# EasyEDA Pro project logic_G1.epro, schematic SCH, sheets 1 to 5 of 10

## Sheets
1 FPGA: Board Name: 立创·逻辑派—G1开发板; Create Date: 2025-03-18; Page Name: FPGA; Project Name: Logic_G1; Schematic Name: SCH; Update Date: 2025-03-18; Company: 嘉立创EDA; Page Size: A4; Version: V1.0
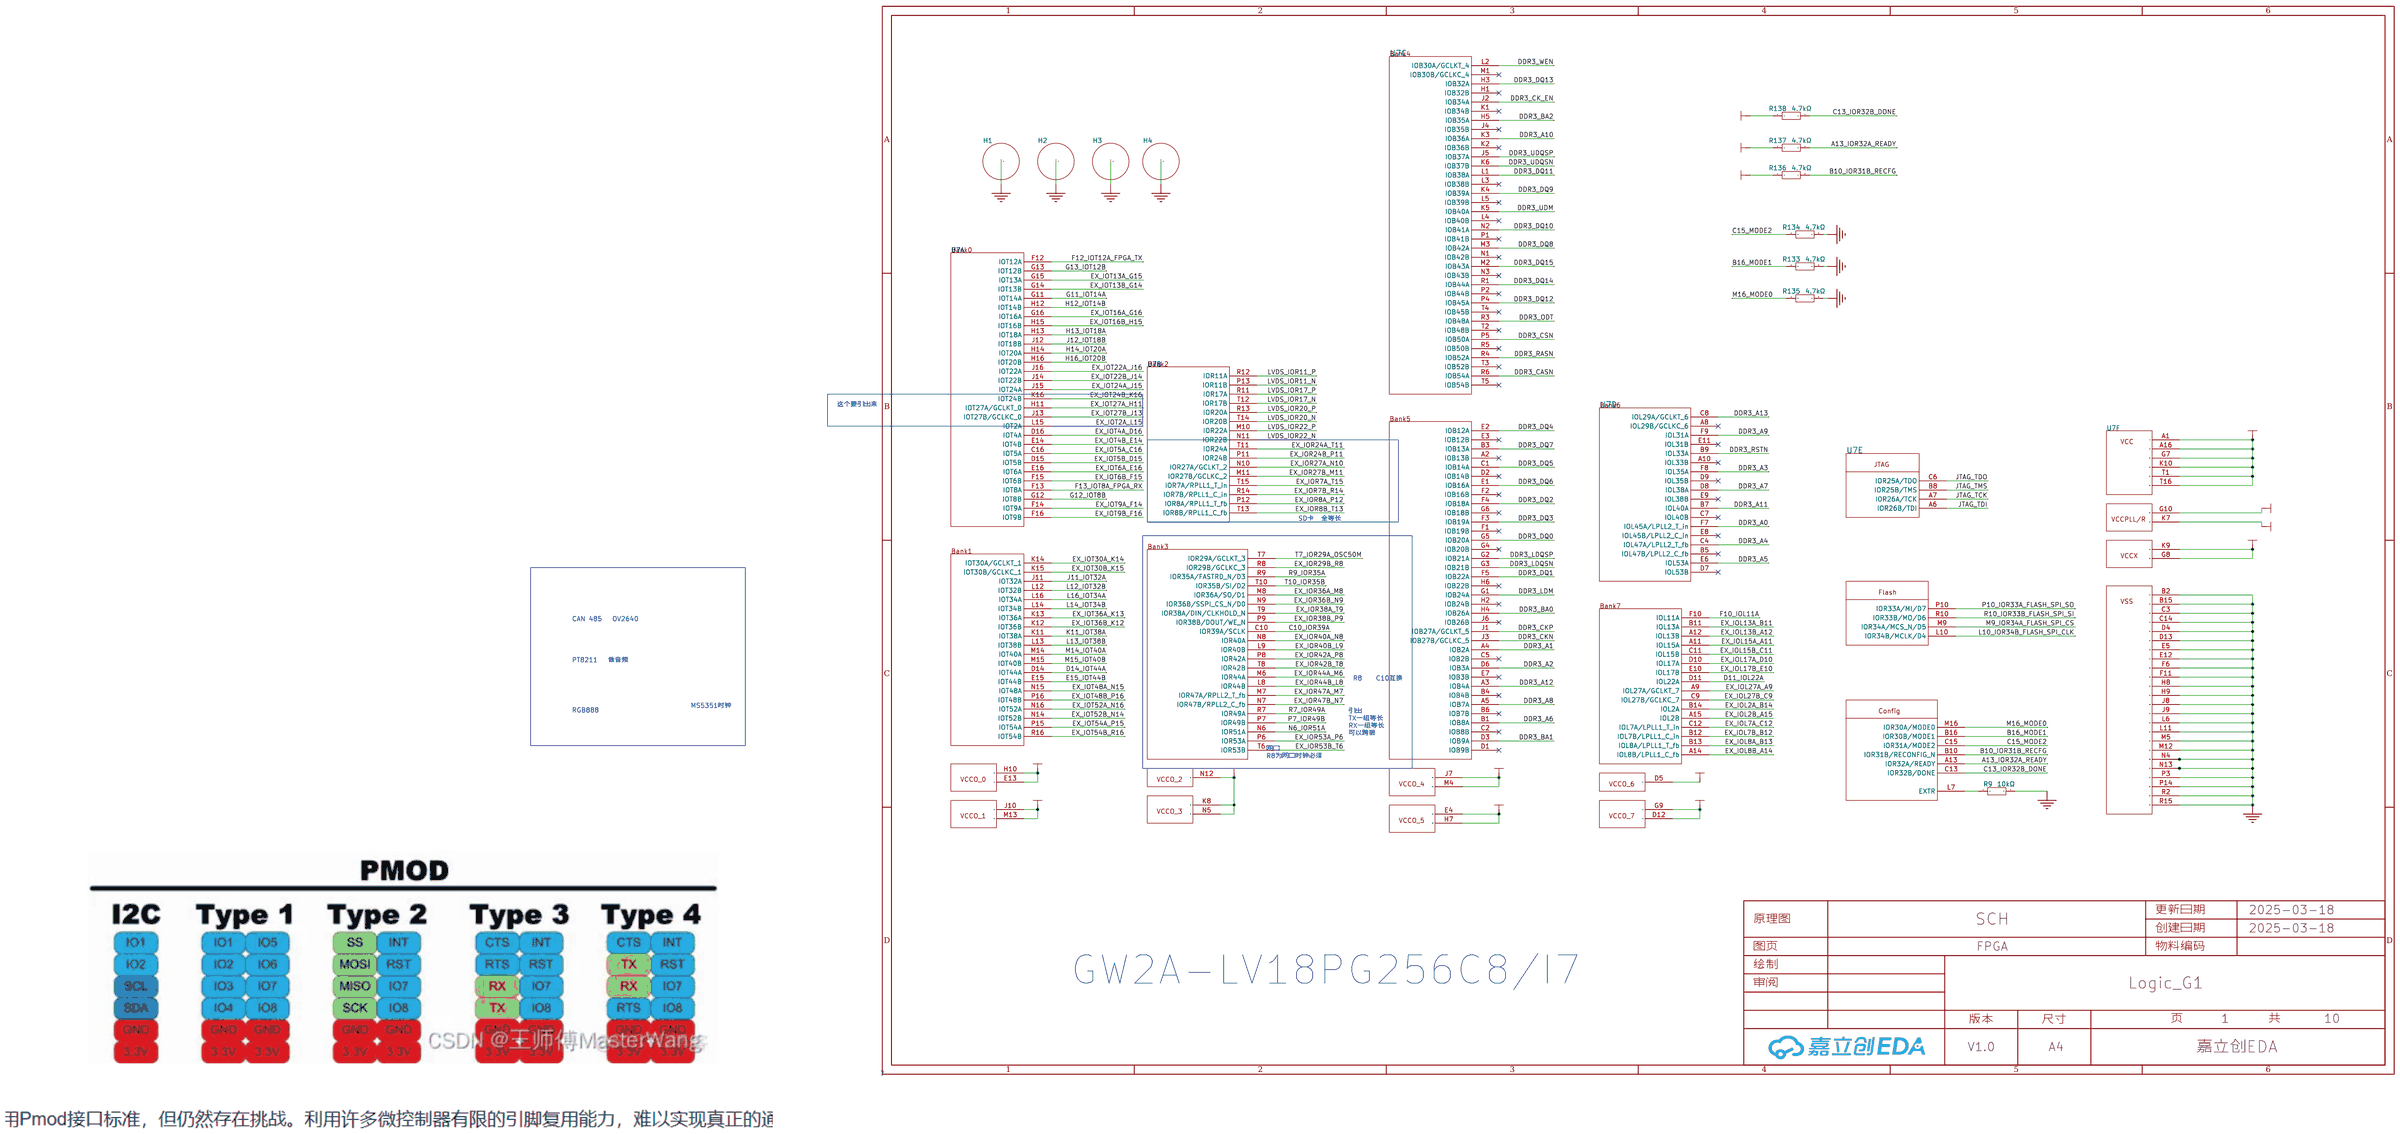
[diagram p0: FPGA]
2 GD32F303CBT6: Board Name: 第六版; Create Date: 2024-11-01; Page Name: GD32F303CBT6; Project Name: FPGA+MCU核心板; Schematic Name: SCH_13; Update Date: 2024-11-01
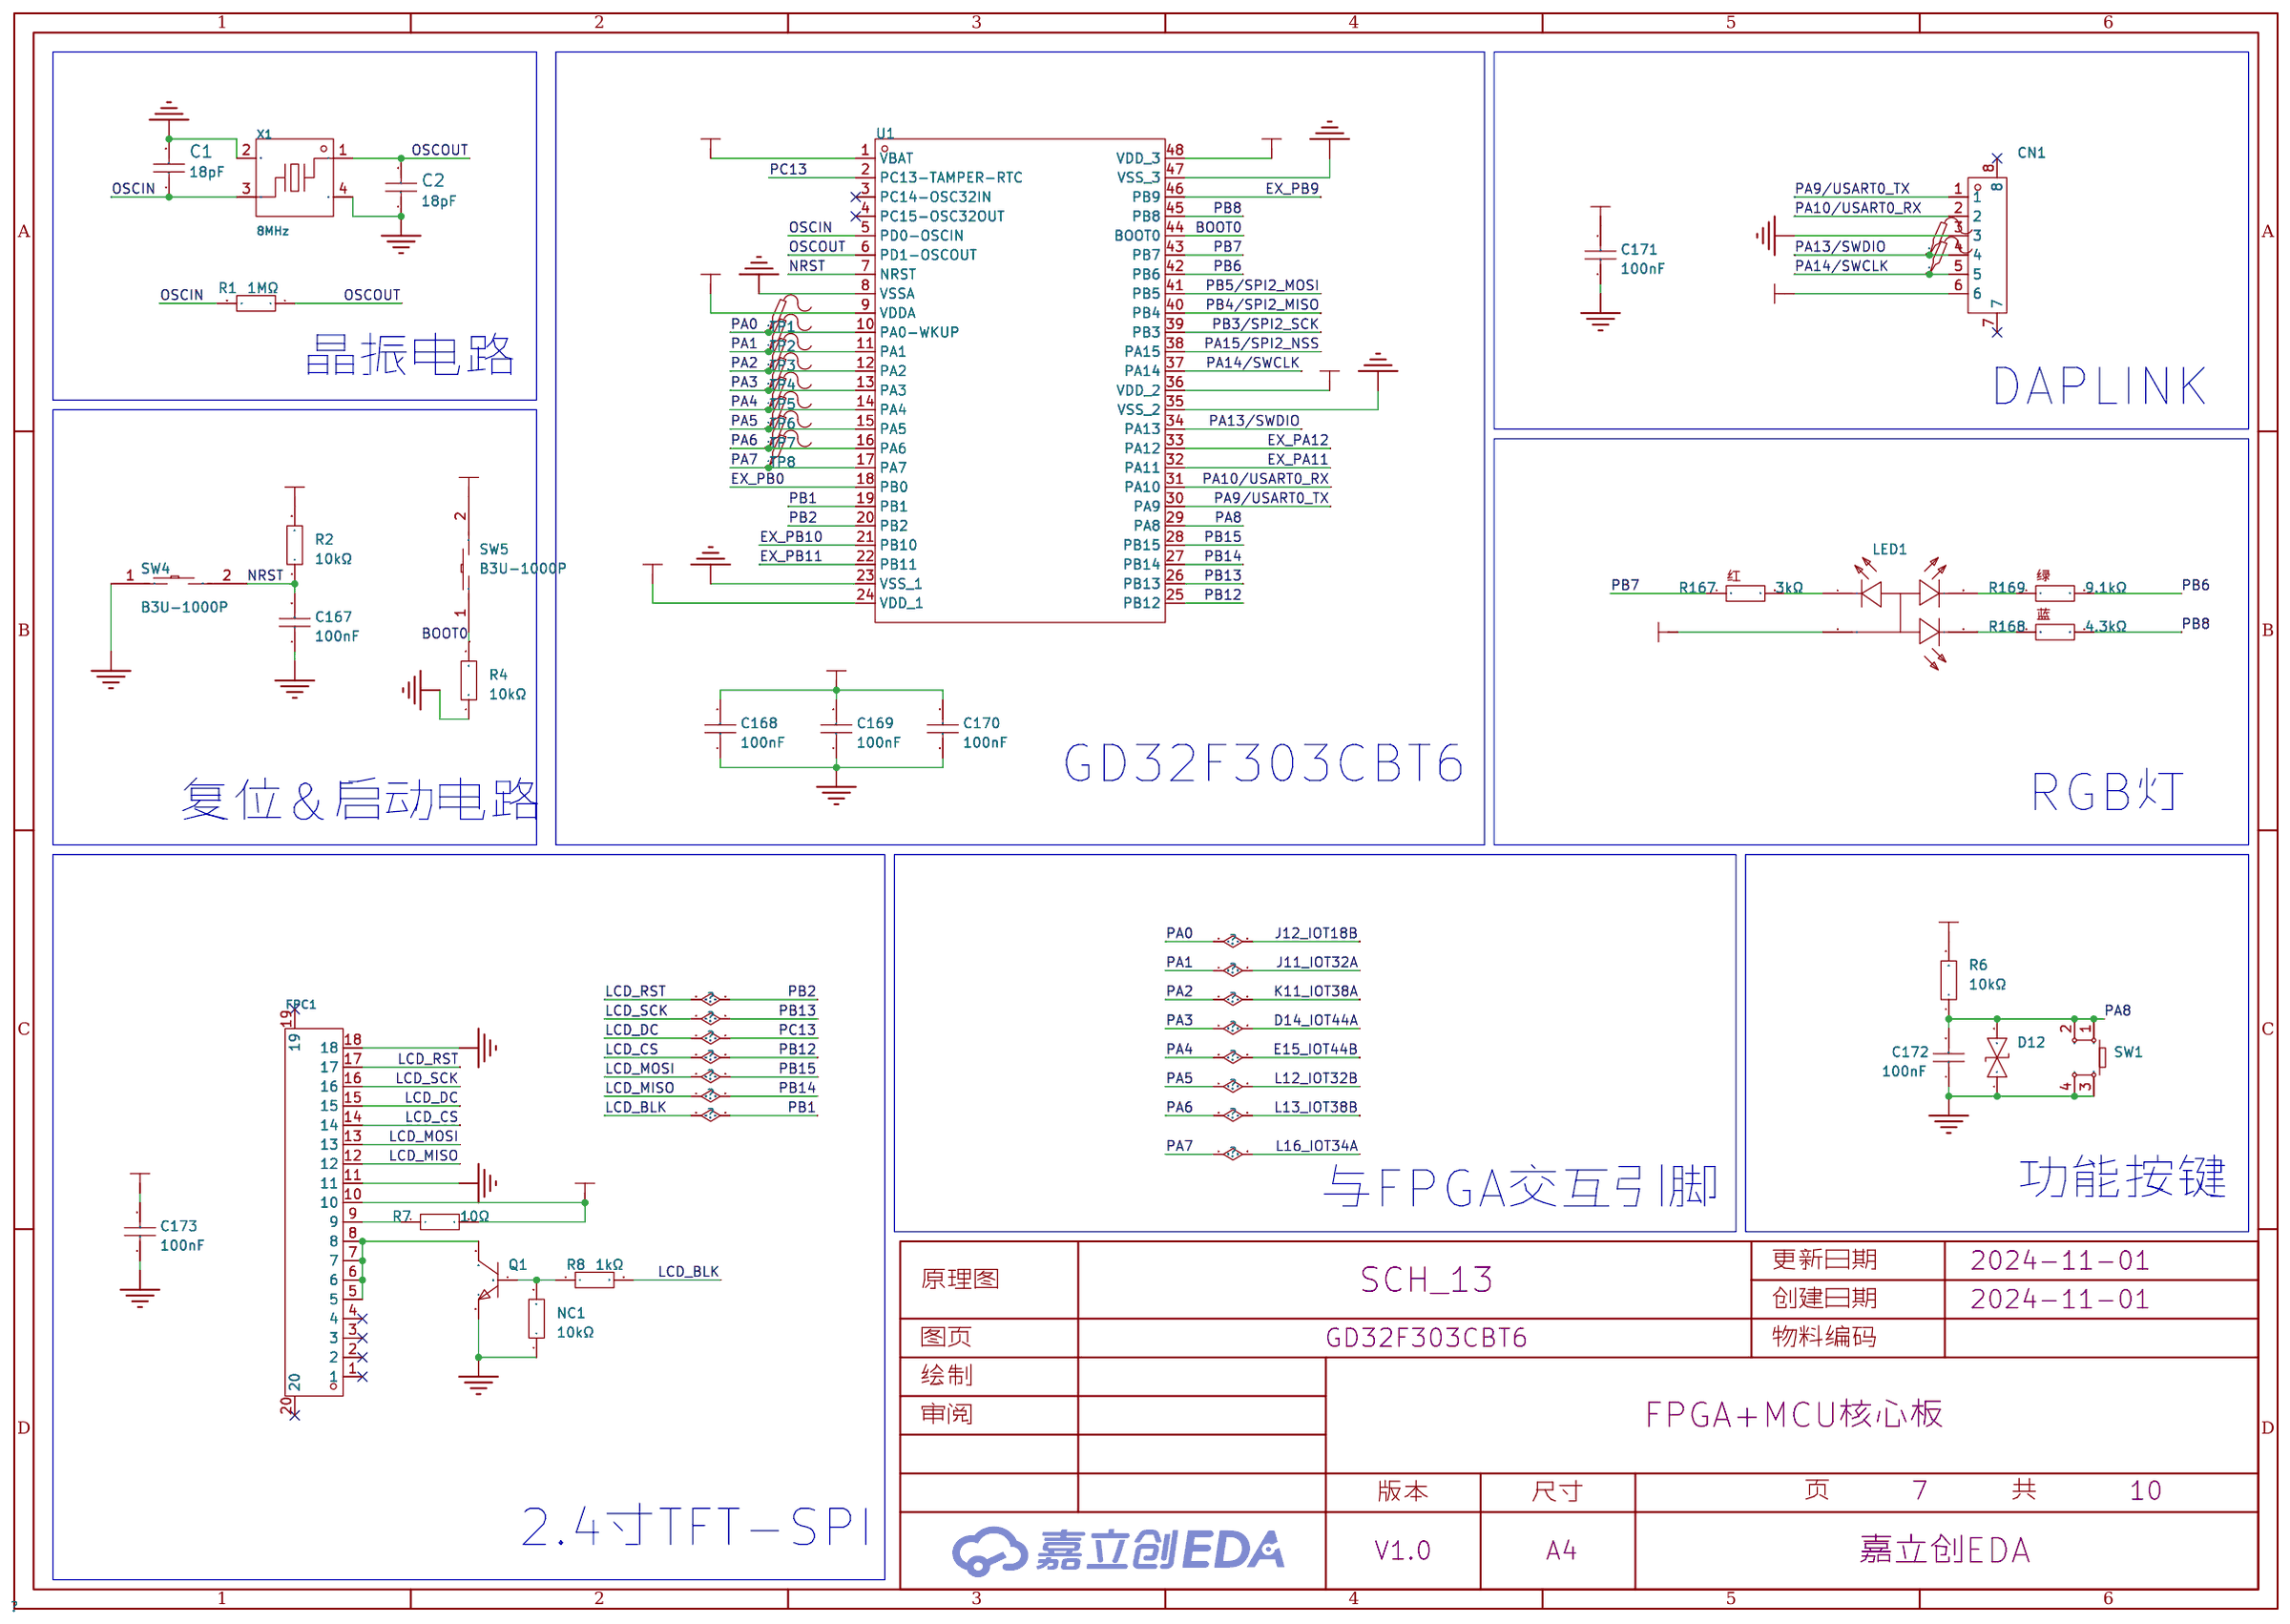
[diagram p1: GD32F303CBT6]
3 Expand: Board Name: 第六版; Create Date: 2024-11-01; Page Name: Expand; Project Name: FPGA+MCU核心板; Schematic Name: SCH_13; Update Date: 2024-11-01
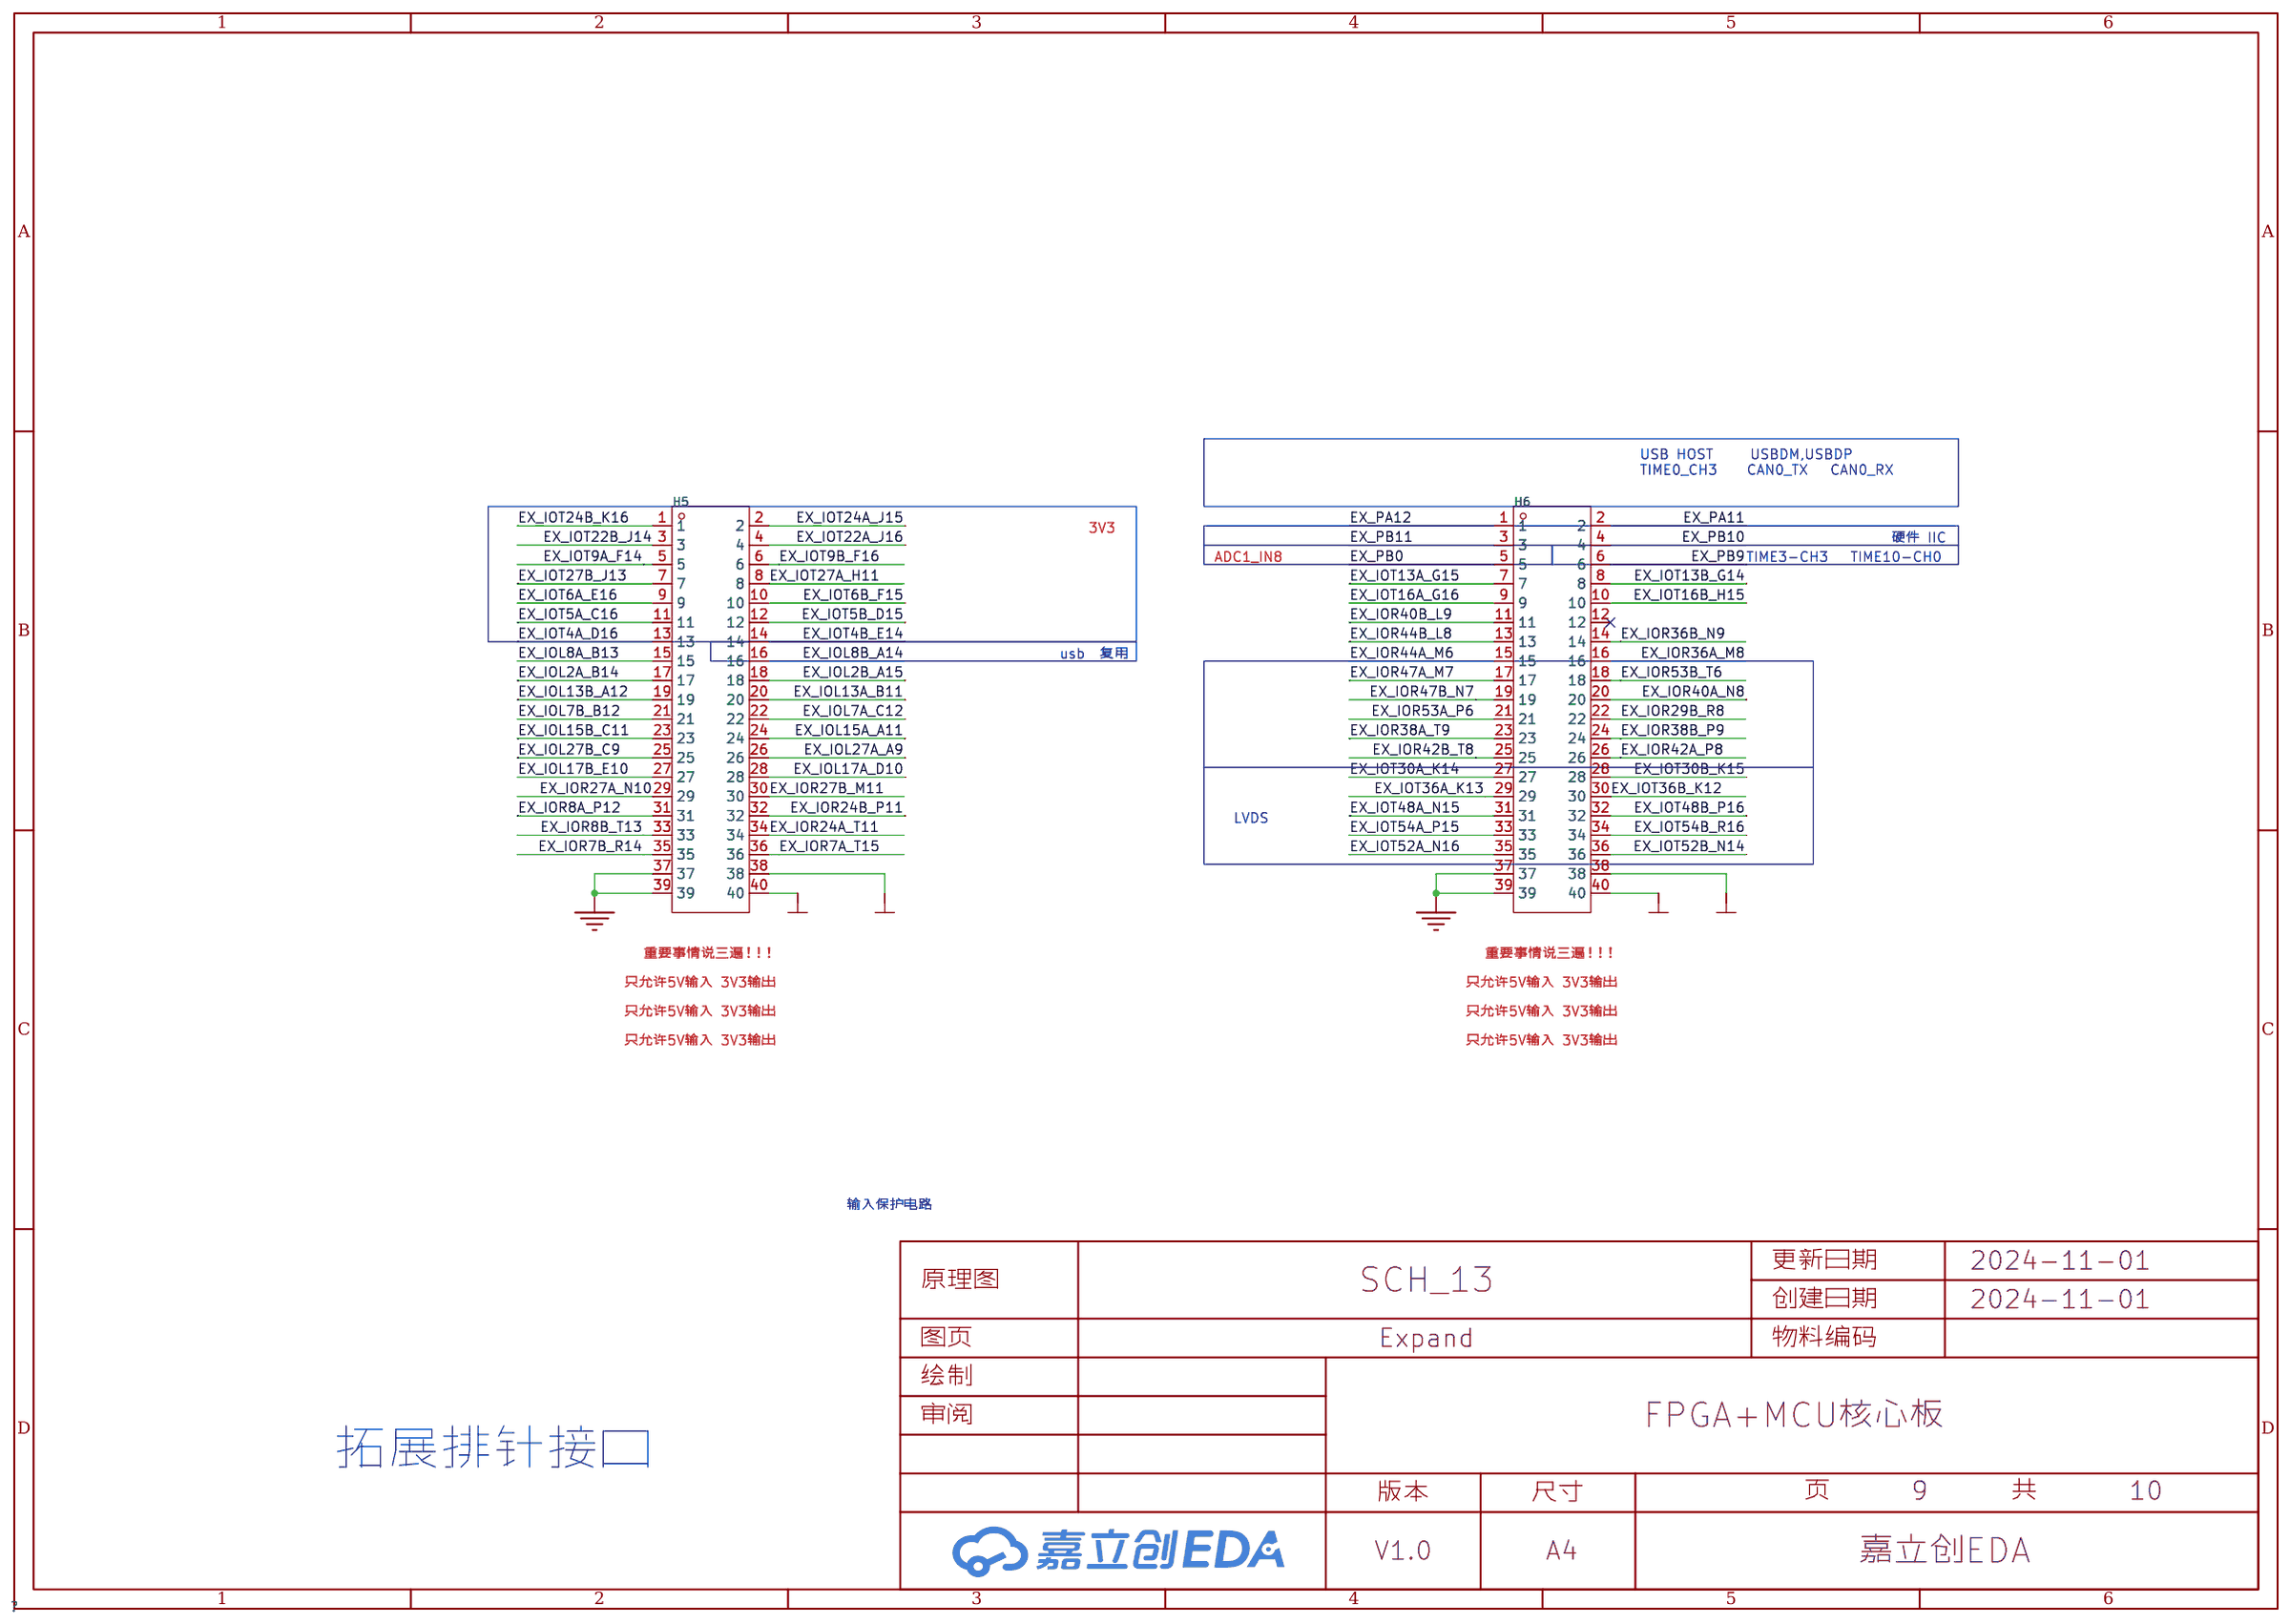
[diagram p2: Expand]
4 FPGA_Peripheral: Board Name: 第六版（单板）; Create Date: 2024-11-05; Page Name: FPGA_Peripheral; Project Name: FPGA+MCU核心板; Schematic Name: SCH_14; Update Date: 2024-11-05
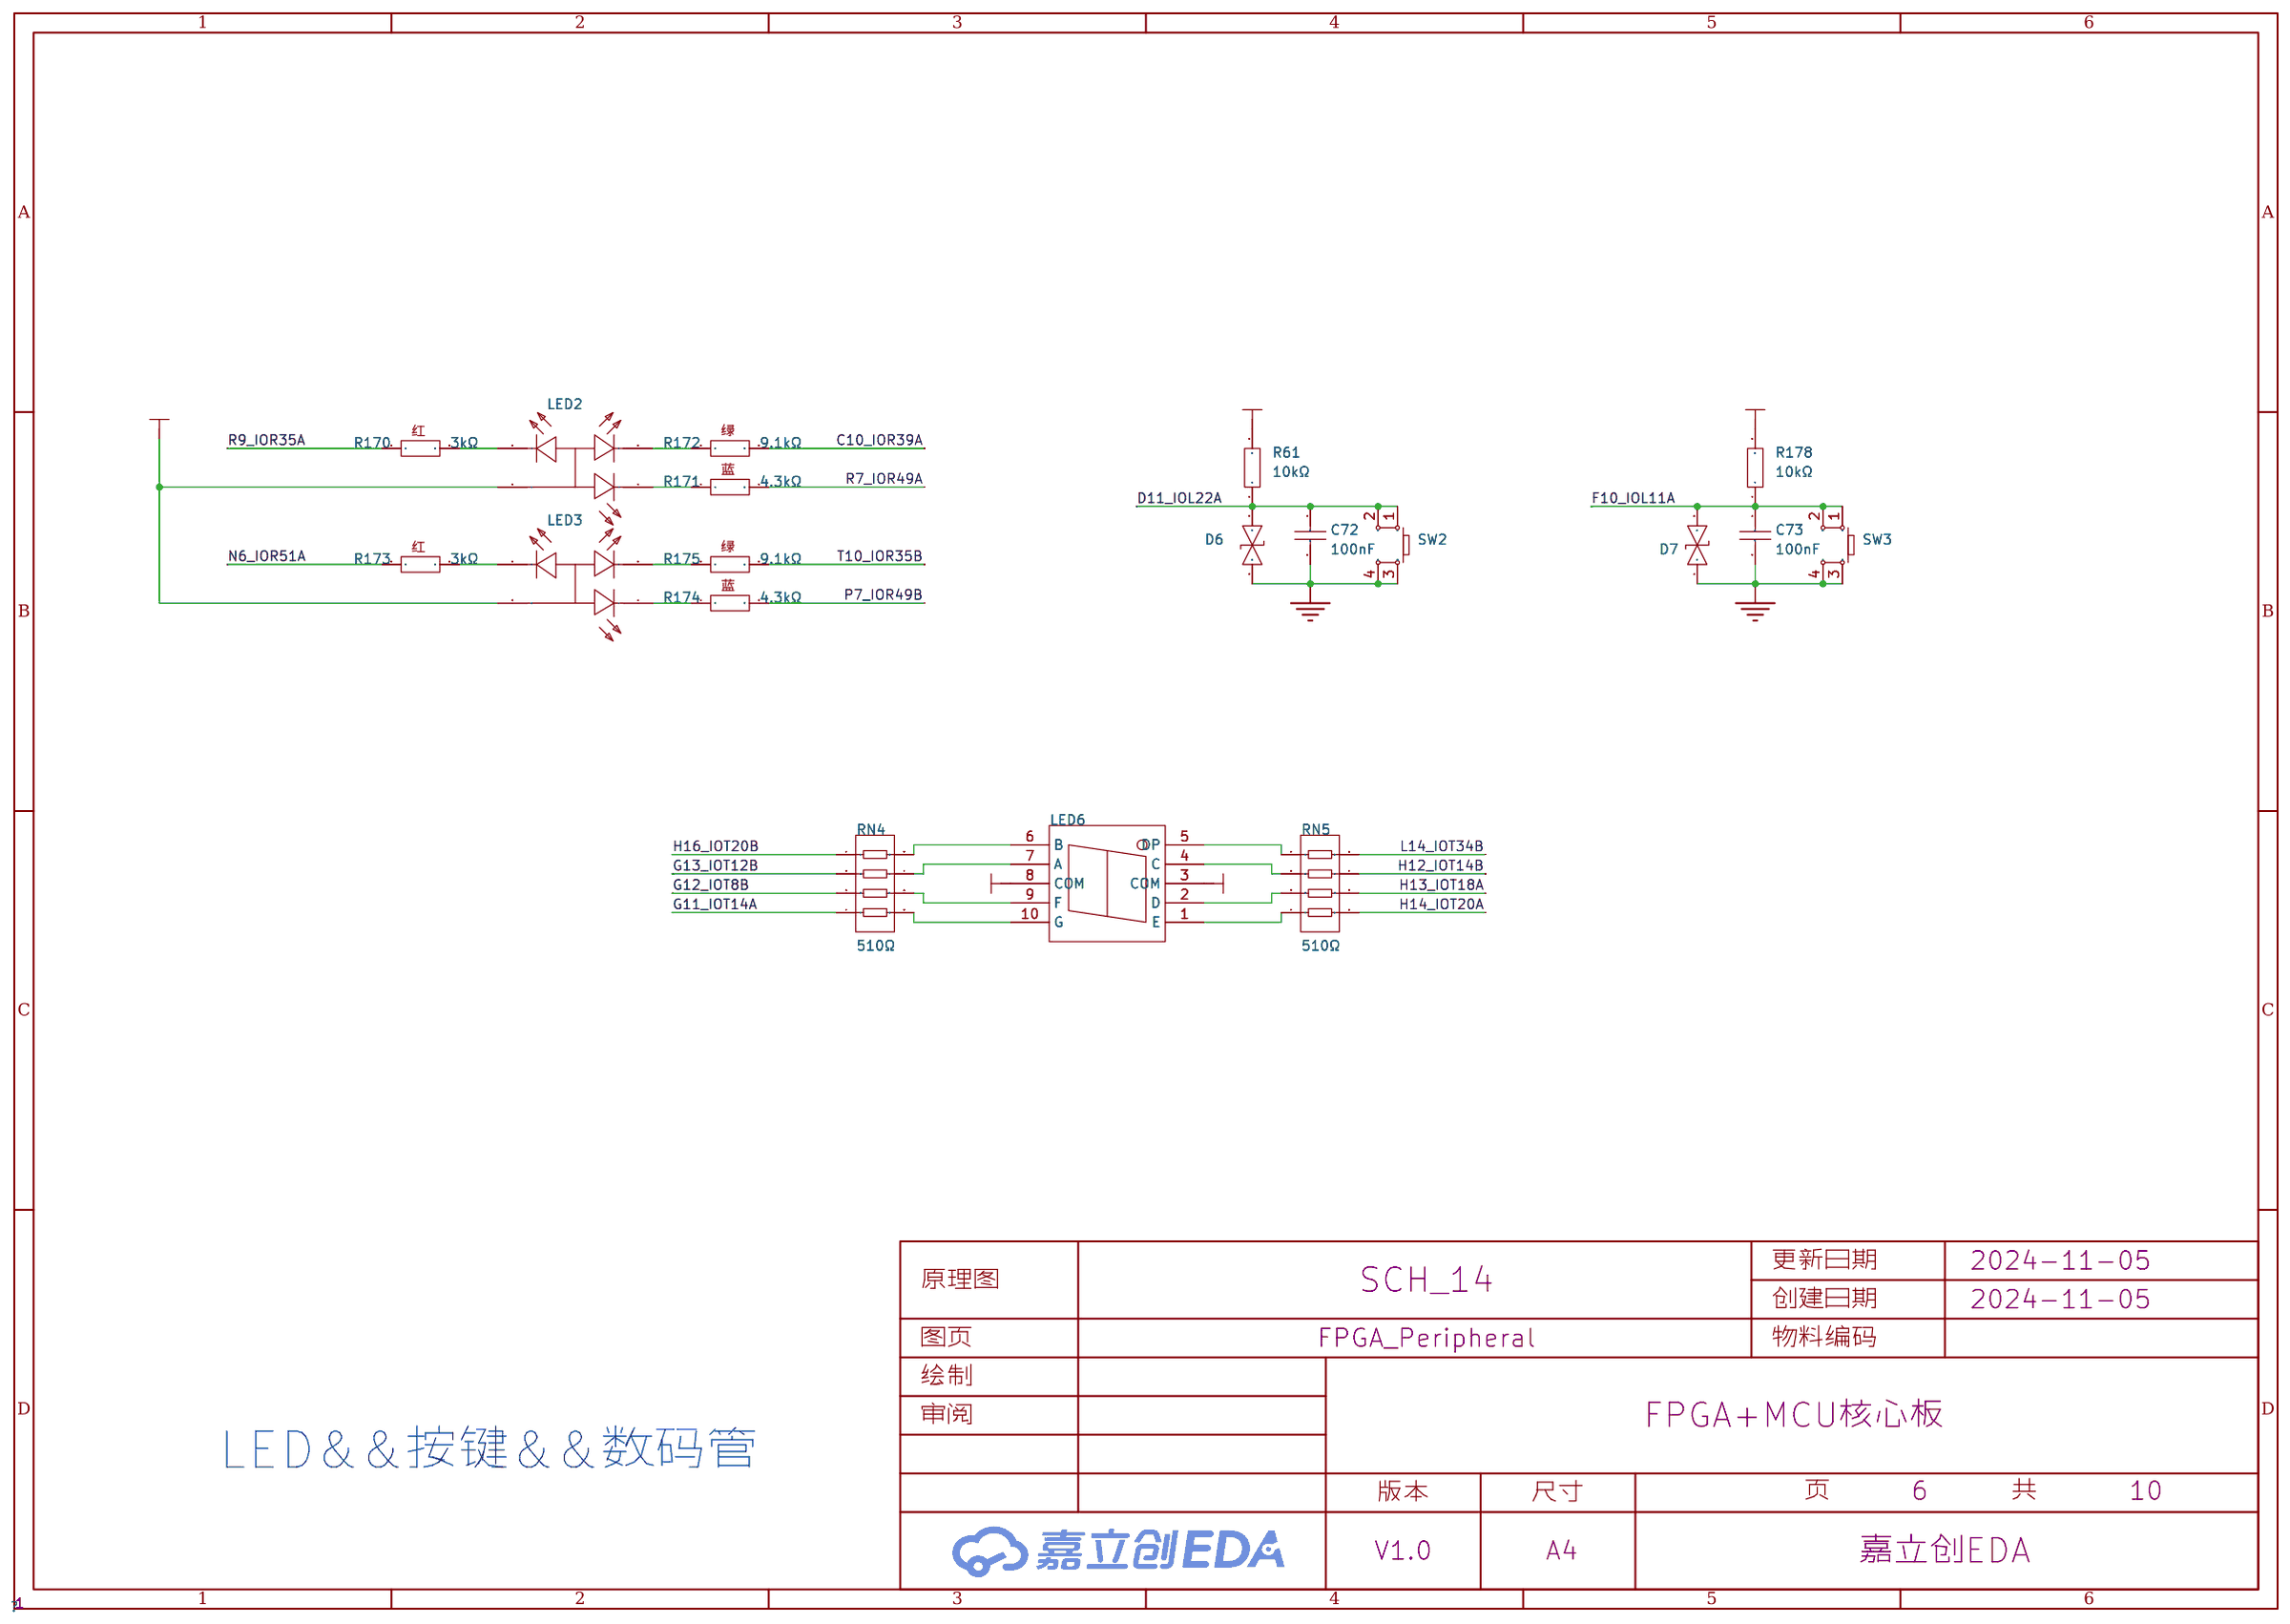
[diagram p3: FPGA_Peripheral]
5 Power: Board Name: 第六版; Create Date: 2024-11-01; Page Name: Power; Project Name: FPGA+MCU核心板; Schematic Name: SCH_13; Update Date: 2024-11-01
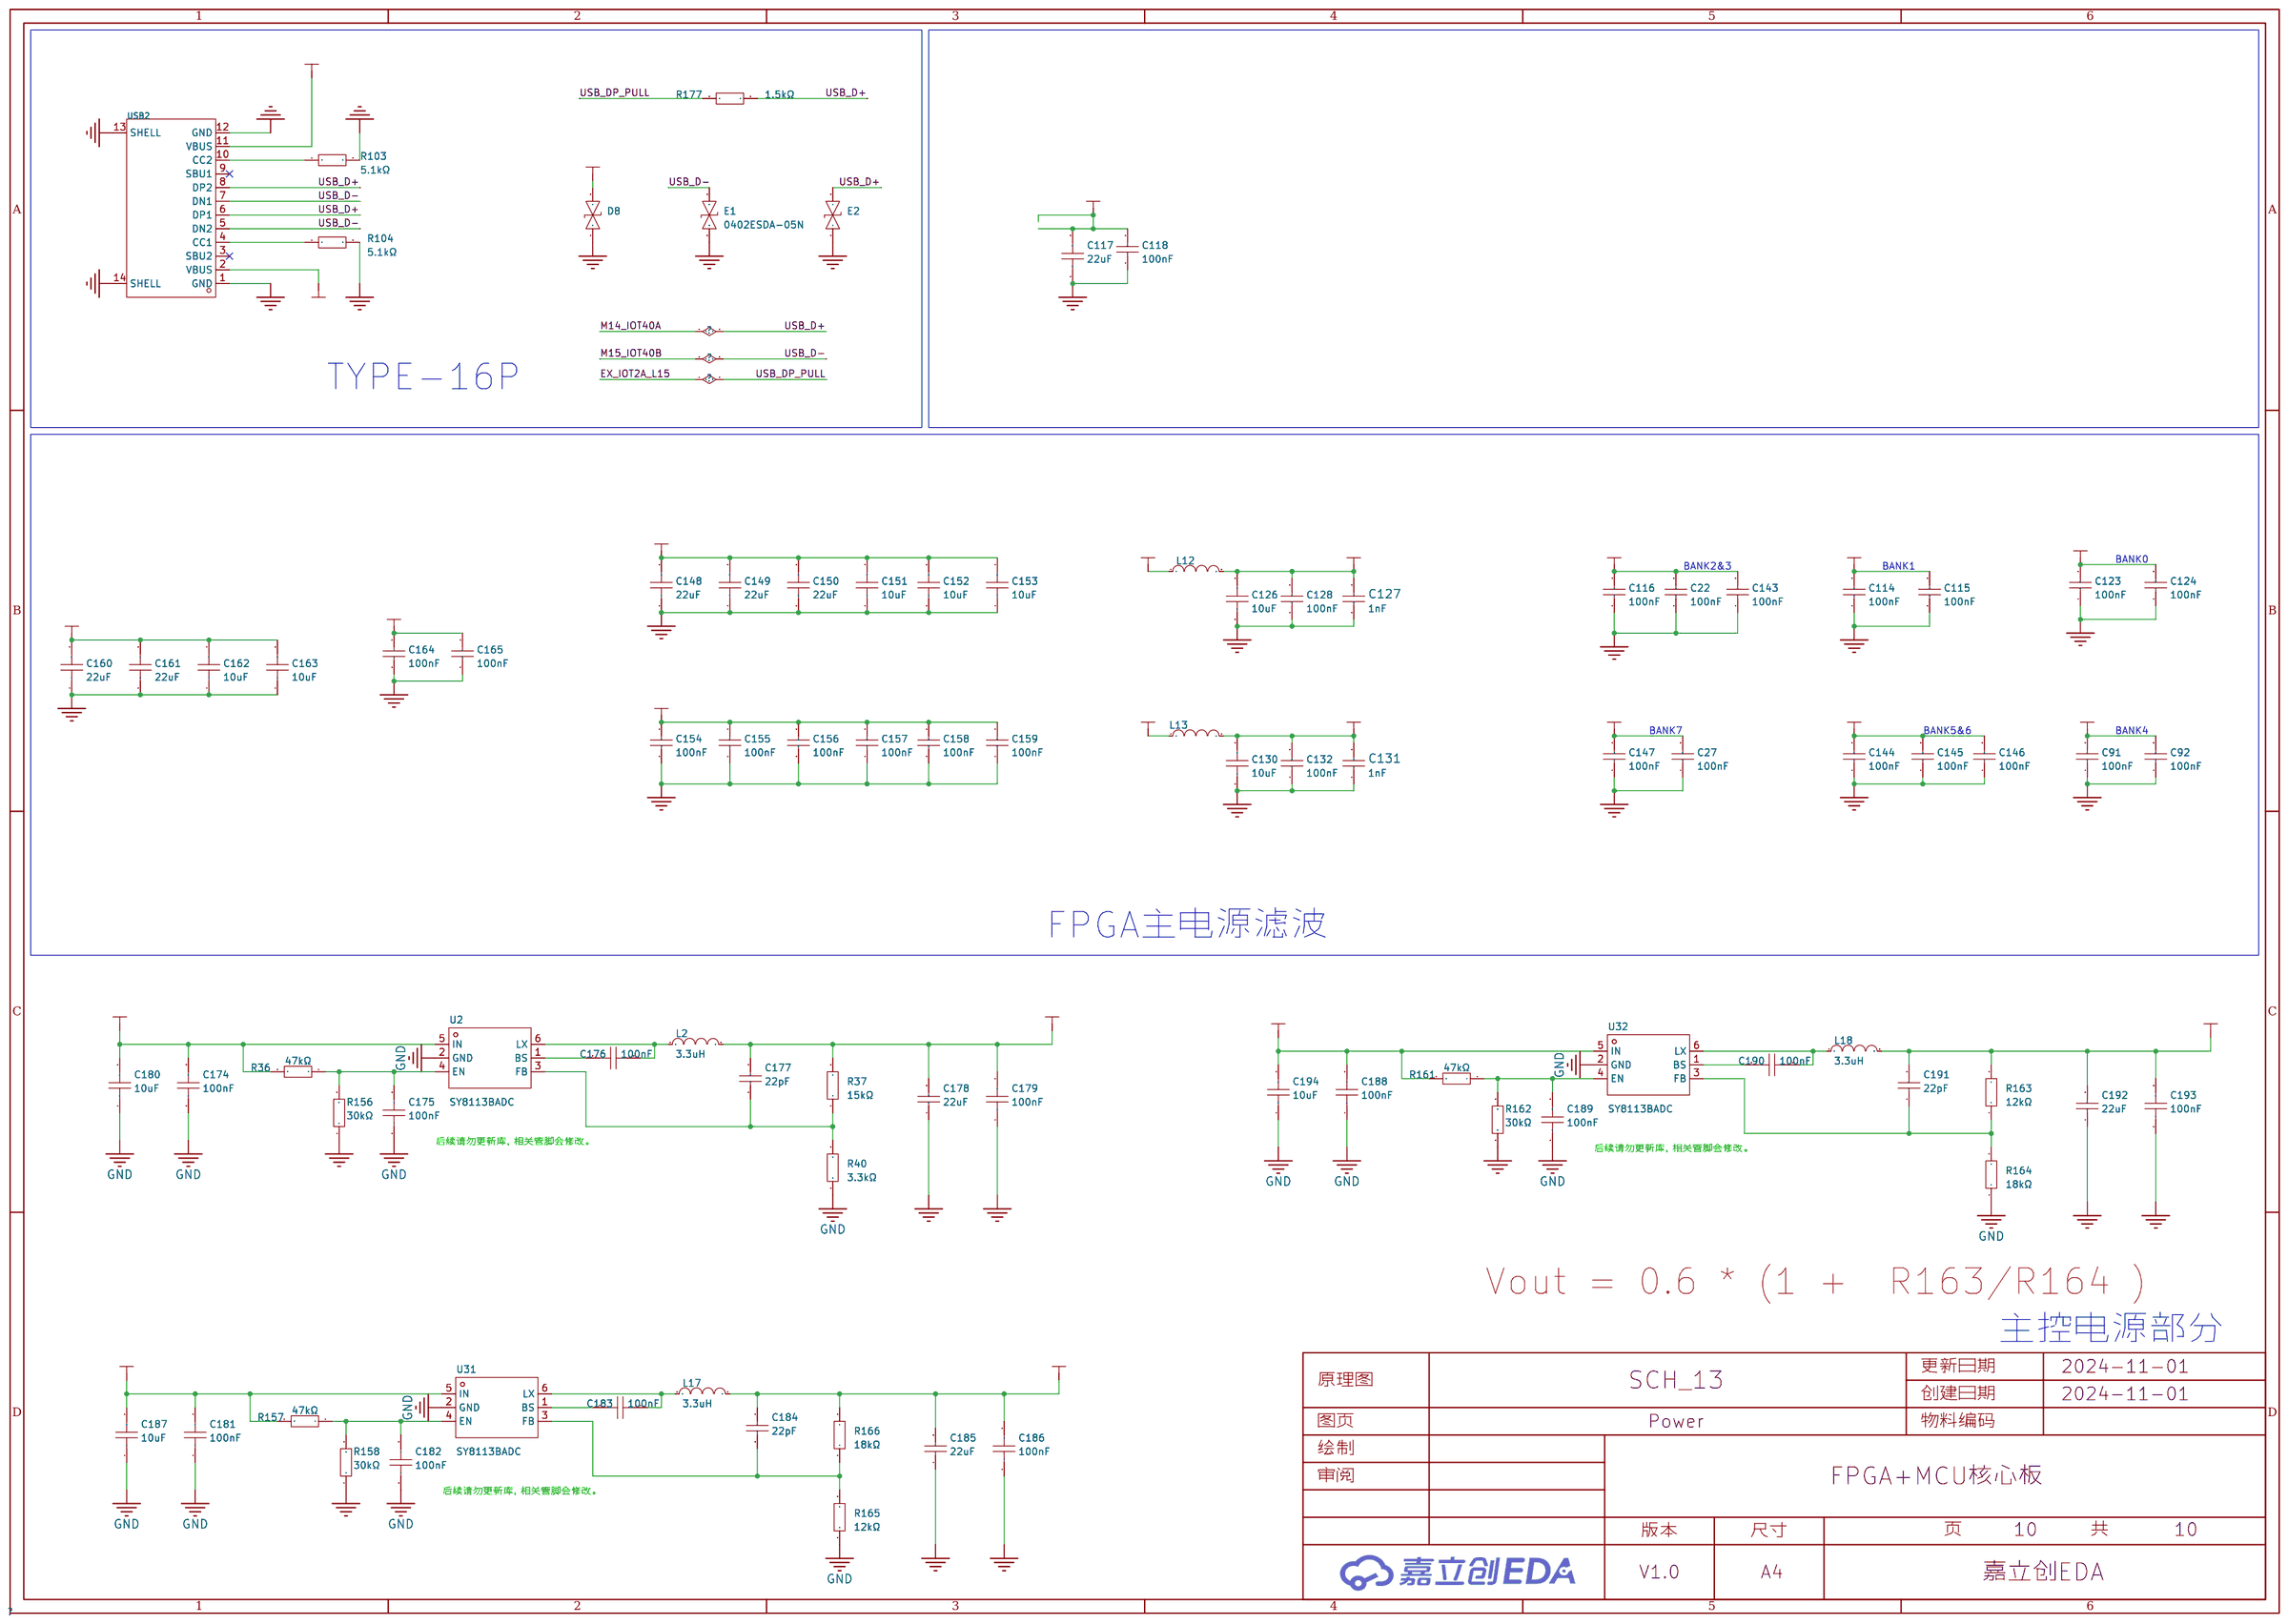
[diagram p4: Power]

## Parts
sheet Expand
H5  12251220ANG0S115001  [HDR-TH_40P-P2.54-V-M-R2-C20-S2.54]
H6  12251220ANG0S115001  [HDR-TH_40P-P2.54-V-M-R2-C20-S2.54]
sheet FPGA
H1  -  [125 X 300]
H2  -  [125 X 300]
H3  -  [125 X 300]
H4  -  [125 X 300]
R9  10kΩ  [R0402]
R133  4.7kΩ  [R0402]
R134  4.7kΩ  [R0402]
R135  4.7kΩ  [R0402]
R136  4.7kΩ  [R0402]
R137  4.7kΩ  [R0402]
R138  4.7kΩ  [R0402]
U7  -  [FBGA-256_L17.0-W17.0-R16-C16-P1.00-TL-1]  (sections Bank0-1,Bank2-3,Bank4-5,Bank6-7,Config,Power)
sheet FPGA_Peripheral
C72  100nF  [C0402]
C73  100nF  [C0402]
D6  0402ESDA-05N  [D0402-BI]
D7  0402ESDA-05N  [D0402-BI]
LED2  E6C0606RGBC3UDA  [LED-SMD_4P-L1.6-W1.6-TL-FD]
LED3  E6C0606RGBC3UDA  [LED-SMD_4P-L1.6-W1.6-TL-FD]
LED6  SLS0281FR1A1GD  [LED-SEG-SMD_SLS0281FR1A1GD]
R61  10kΩ  [R0402]
R170  3kΩ  [R0402]
R171  4.3kΩ  [R0402]
R172  9.1kΩ  [R0402]
R173  3kΩ  [R0402]
R174  4.3kΩ  [R0402]
R175  9.1kΩ  [R0402]
R178  10kΩ  [R0402]
RN4  510Ω  [RES-ARRAY-SMD_0402-8P-L2.0-W1.0-BL]
RN5  510Ω  [RES-ARRAY-SMD_0402-8P-L2.0-W1.0-BL]
SW2  PTS815SJK250SMTRLFS  [SW-SMD_4P-L4.2-W3.3-P2.15-LS5.1]
SW3  PTS815SJK250SMTRLFS  [SW-SMD_4P-L4.2-W3.3-P2.15-LS5.1]
sheet GD32F303CBT6
C1  18pF  [C0402]
C2  18pF  [C0402]
C167  100nF  [C0402]
C168  100nF  [C0402]
C169  100nF  [C0402]
C170  100nF  [C0402]
C171  100nF  [C0402]
C172  100nF  [C0402]
C173  100nF  [C0402]
CN1  WAFER-100W-6A  [CONN-SMD_6P-P1.00_XUNPU_WAFER-100W-6P]
D12  0402ESDA-05N  [D0402-BI]
FPC1  FPC-05F-18PH20  [FPC-SMD_18P-P0.50_FPC-05F-18PH20]
LED1  E6C0606RGBC3UDA  [LED-SMD_4P-L1.6-W1.6-TL-FD]
NC1  10kΩ  [R0402]
Q1  S8050 J3Y  [SOT-23-3_L3.0-W1.7-P0.95-LS2.9-BR]
R1  1MΩ  [R0402]
R2  10kΩ  [R0402]
R4  10kΩ  [R0402]
R6  10kΩ  [R0402]
R7  10Ω  [R0402]
R8  1kΩ  [R0402]
R167  3kΩ  [R0402]
R168  4.3kΩ  [R0402]
R169  9.1kΩ  [R0402]
SW1  PTS815SJK250SMTRLFS  [SW-SMD_4P-L4.2-W3.3-P2.15-LS5.1]
SW4  B3U-1000P  [KEY-SMD_B3U-1000PM]
SW5  B3U-1000P  [KEY-SMD_B3U-1000PM]
TP1  -  [Test-Point-0.5mm]
TP2  -  [Test-Point-0.5mm]
TP3  -  [Test-Point-0.5mm]
TP4  -  [Test-Point-0.5mm]
TP5  -  [Test-Point-0.5mm]
TP6  -  [Test-Point-0.5mm]
TP7  -  [Test-Point-0.5mm]
TP8  -  [Test-Point-0.5mm]
TP9  -  [Test-Point-0.5mm]
TP10  -  [Test-Point-0.5mm]
U1  GD32F303CBT6  [LQFP-48_L7.0-W7.0-P0.50-LS9.0-BL]
X1  8MHz  [OSC-SMD_4P-L3.2-W2.5-BL]
sheet Power
C22  100nF  [C0402]
C27  100nF  [C0402]
C91  100nF  [C0402]
C92  100nF  [C0402]
C114  100nF  [C0402]
C115  100nF  [C0402]
C116  100nF  [C0402]
C117  22uF  [C0603]
C118  100nF  [C0402]
C123  100nF  [C0402]
C124  100nF  [C0402]
C126  10uF  [C0603]
C127  1nF  [C0402]
C128  100nF  [C0402]
C130  10uF  [C0603]
C131  1nF  [C0402]
C132  100nF  [C0402]
C143  100nF  [C0402]
C144  100nF  [C0402]
C145  100nF  [C0402]
C146  100nF  [C0402]
C147  100nF  [C0402]
C148  22uF  [C0603]
C149  22uF  [C0603]
C150  22uF  [C0603]
C151  10uF  [C0603]
C152  10uF  [C0603]
C153  10uF  [C0603]
C154  100nF  [C0402]
C155  100nF  [C0402]
C156  100nF  [C0402]
C157  100nF  [C0402]
C158  100nF  [C0402]
C159  100nF  [C0402]
C160  22uF  [C0603]
C161  22uF  [C0603]
C162  10uF  [C0603]
C163  10uF  [C0603]
C164  100nF  [C0402]
C165  100nF  [C0402]
C174  100nF  [R0603]
C175  100nF  [R0402]
C176  100nF  [R0402]
C177  22pF  [R0402]
C178  22uF  [C0603]
C179  100nF  [R0603]
C180  10uF  [C0603]
C181  100nF  [R0603]
C182  100nF  [R0402]
C183  100nF  [R0402]
C184  22pF  [R0402]
C185  22uF  [C0603]
C186  100nF  [R0603]
C187  10uF  [C0603]
C188  100nF  [R0603]
C189  100nF  [R0402]
C190  100nF  [R0402]
C191  22pF  [R0402]
C192  22uF  [C0603]
C193  100nF  [R0603]
C194  10uF  [C0603]
D8  0402ESDA-05N  [D0402-BI]
E1  0402ESDA-05N  [D0402-BI]
E2  0402ESDA-05N  [D0402-BI]
L2  3.3uH  [IND-SMD_L4.4-W4.2]
L12  UPZ1005D121-1R3TF  [L0402]
L13  UPZ1005D121-1R3TF  [L0402]
L17  3.3uH  [IND-SMD_L4.4-W4.2]
L18  3.3uH  [IND-SMD_L4.4-W4.2]
R36  47kΩ  [R0402]
R37  15kΩ  [R0402]
R40  3.3kΩ  [R0402]
R103  5.1kΩ  [R0402]
R104  5.1kΩ  [R0402]
R156  30kΩ  [R0402]
R157  47kΩ  [R0402]
R158  30kΩ  [R0402]
R161  47kΩ  [R0402]
R162  30kΩ  [R0402]
R163  12kΩ  [R0402]
R164  18kΩ  [R0402]
R165  12kΩ  [R0402]
R166  18kΩ  [R0402]
R177  1.5kΩ  [R0402]
U2  SY8113BADC  [TSOT-23-6_L2.9-W1.6-P0.95-LS2.8-BR]
U31  SY8113BADC  [TSOT-23-6_L2.9-W1.6-P0.95-LS2.8-BR]
U32  SY8113BADC  [TSOT-23-6_L2.9-W1.6-P0.95-LS2.8-BR]
USB2  TYPE-C 16PIN 2MD(073)  [USB-C-SMD_TYPE-C-6PIN-2MD-073]

## Library data of the parts
H5 H6 = 12251220ANG0S115001: 排数:双排;总PIN位数:40P;间距:2.54mm;插针结构:2x20P;行距:2.54mm;安装类型:直插;圆针/方针:方针;额定电流:3A;额定电压:-;配合针长度:6mm;塑高:2.5mm;端接针长度:3mm;触头材质:黄铜;触头镀层:-;工作温度范围:-40℃~+105℃;颜色:黑色;; LCSC Part Name: 2.54mm 2x20P 直插 方针; Supplier Part: C429965; Manufacturer: JILN(锦凌); Supplier Footprint: 插件,P=2.54mm; JLCPCB Part Class: 扩展库; Datasheet: https://atta.szlcsc.com/upload/public/pdf/source/20190920/C429965_BC46B4ED575BB92CEF1C6420E537C4AD.pdf; Supplier: LCSC; Number of Rows: 双排; Number of Pins: 40P; Pitch: 2.54mm; Pin Structure: 2x20P; Row Spacing: 2.54mm; Mounting Type: 直插; Circluar Pins/Square Pins: 方针; Current Rating (Max): 3A; Length of Mating Pin: 6mm; Insulation Height: 2.5mm; Length of End Connection Pin: 3mm; Contact Material: 黄铜; Operating Temperature Range: -40℃~+105℃; Color: 黑色
H1-H4 = 125 X 300: Check: false
NC1 R2 R4 R6 R9 R61 R178 = 0402WGF1002TCE: 电阻类型:厚膜电阻;阻值:10kΩ;精度:±1%;功率:62.5mW;温度系数:±100ppm/℃;; LCSC Part Name: 厚膜电阻 10kΩ ±1% 62.5mW; Supplier Part: C25744; Manufacturer: UNI-ROYAL(厚声); Supplier Footprint: 0402; JLCPCB Part Class: 基础库; Datasheet: https://atta.szlcsc.com/upload/public/pdf/source/20200306/C422600_1E6D84923E4A46A82E41ADD87F860B5C.pdf; Supplier: LCSC; Type: 厚膜电阻; Tolerance: ±1%; Power(Watts): 62.5mW; Temperature Coefficient: ±100ppm/℃; Overload Voltage (Max): 50V; Operating Temperature Range: -55℃~+155℃
R133-R138 = 0402WGF4701TCE: 电阻类型:厚膜电阻;阻值:4.7kΩ;精度:±1%;功率:62.5mW;温度系数:±100ppm/℃;; LCSC Part Name: 厚膜电阻 4.7kΩ ±1% 62.5mW; Supplier Part: C25900; Manufacturer: UNI-ROYAL(厚声); Supplier Footprint: 0402; JLCPCB Part Class: 基础库; Datasheet: https://atta.szlcsc.com/upload/public/pdf/source/20200306/C422600_1E6D84923E4A46A82E41ADD87F860B5C.pdf; Supplier: LCSC; Type: 厚膜电阻; Tolerance: ±1%; Power(Watts): 62.5mW; Temperature Coefficient: ±100ppm/℃; Overload Voltage (Max): 50V; Operating Temperature Range: -55℃~+155℃
U7 = gw2a-lv18pg256
C22 C27 C72 C73 C91 C92 C114-C116 C118 C123 C124 C128 C132 C143-C147 C154-C159 C164 C165 C167-C173 = CL05B104KO5NNNC: 容值:100nF;精度:±10%;额定电压:16V;材质(温度系数):X7R;; LCSC Part Name: 100nF ±10% 16V; Supplier Part: C1525; Manufacturer: SAMSUNG(三星); Supplier Footprint: 0402; JLCPCB Part Class: 基础库; Datasheet: https://atta.szlcsc.com/upload/public/pdf/source/20160218/1457707763339.pdf; Supplier: LCSC; Tolerance: ±10%; Voltage Rated: 16V; Temperature Coefficient: X7R
D6-D8 D12 E1 E2 = 0402ESDA-05N: 极性:双向;反向截止电压(Vrwm):5V;钳位电压(Vc)@Ipp:50V;; LCSC Part Name: 双向ESD; Supplier Part: C316049; Manufacturer: BORN(伯恩半导体); Supplier Footprint: 0402; JLCPCB Part Class: 扩展库; Datasheet: https://atta.szlcsc.com/upload/public/pdf/source/20181026/C316049_37ABAC87650F175221BFB473159300DE.pdf; Supplier: LCSC; Polarity: 双向; Reverse Stand-Off Voltage (Vrwm): 5V; Clamping Voltage@Ipp: 50V
LED1-LED3 = E6C0606RGBC3UDA: 发光颜色:RGB三色;; LCSC Part Name: RGB三色; Supplier Part: C375569; Manufacturer: ekinglux(亿晶源); Supplier Footprint: 0603; JLCPCB Part Class: Extended Part; Datasheet: https://atta.szlcsc.com/upload/public/pdf/source/20220330/8DE12FB9881A833E867FD7AF6894B416.pdf; Supplier: LCSC; Emitted Color: RGB三色
LED6 = SLS0281FR1A1GD: 数码管位数:1;数字/字母大小(英寸):0.28;LED极性:共阳;发光颜色:红色;; LCSC Part Name: 0.28英寸,一位,红光,贴片LED数码管; Supplier Part: C225994; Manufacturer: SUNLIGHT(光华); Supplier Footprint: SMD; JLCPCB Part Class: 扩展库; Datasheet: https://atta.szlcsc.com/upload/public/pdf/source/20180809/C225994_07659105DBFE86D4692F62FAD9EC8625.pdf; Supplier: LCSC; Number of Characters: 1; Digit/Alpha Size(inch): 0.28; LED Polarity: 共阳; Luminous Color: 红色
R167 R170 R173 = 0402WGF3001TCE: 电阻类型:厚膜电阻;阻值:3kΩ;精度:±1%;功率:62.5mW;; LCSC Part Name: 3kΩ ±1% 62.5mW; Supplier Part: C25784; Manufacturer: UNI-ROYAL(厚声); Supplier Footprint: 0402; JLCPCB Part Class: Extended Part; Datasheet: https://atta.szlcsc.com/upload/public/pdf/source/20200306/C422600_1E6D84923E4A46A82E41ADD87F860B5C.pdf; Supplier: LCSC; Type: 厚膜电阻; Tolerance: ±1%; Power(Watts): 62.5mW; Temperature Coefficient: ±100ppm/℃; Overload Voltage (Max): 50V; Operating Temperature Range: -55℃~+155℃
R168 R171 R174 = 0402WGF4301TCE: 电阻类型:厚膜电阻;阻值:4.3kΩ;精度:±1%;功率:62.5mW;最大工作电压:50V;温度系数:±100ppm/℃;; LCSC Part Name: 4.3kΩ ±1% 62.5mW 厚膜电阻; Supplier Part: C25899; Manufacturer: UNI-ROYAL(厚声); Supplier Footprint: 0402; JLCPCB Part Class: 扩展库; Datasheet: https://atta.szlcsc.com/upload/public/pdf/source/20200306/C422600_1E6D84923E4A46A82E41ADD87F860B5C.pdf; Supplier: LCSC; Type: 厚膜电阻; Tolerance: ±1%; Power(Watts): 62.5mW; Overload Voltage (Max): 50V; Temperature Coefficient: ±100ppm/℃; Operating Temperature Range: -55℃~+155℃
R169 R172 R175 = 0402WGF9101TCE: 电阻类型:厚膜电阻;阻值:9.1kΩ;精度:±1%;功率:62.5mW;; LCSC Part Name: 9.1kΩ ±1% 62.5mW; Supplier Part: C25926; Manufacturer: UNI-ROYAL(厚声); Supplier Footprint: 0402; JLCPCB Part Class: Extended Part; Datasheet: https://atta.szlcsc.com/upload/public/pdf/source/20200306/C422600_1E6D84923E4A46A82E41ADD87F860B5C.pdf; Supplier: LCSC; Type: 厚膜电阻; Tolerance: ±1%; Power(Watts): 62.5mW; Temperature Coefficient: ±100ppm/℃; Overload Voltage (Max): 50V; Operating Temperature Range: -55℃~+155℃
RN4 RN5 = 4D02WGJ0511TCE: 阻值:510Ω;精度:±5%;单个元件功率:62.5mW;电阻器数:4;; LCSC Part Name: 510Ω ±5% 0402x4; Supplier Part: C425248; Manufacturer: UNI-ROYAL(厚声); Supplier Footprint: 0402x4; JLCPCB Part Class: 扩展库; Datasheet: https://atta.szlcsc.com/upload/public/pdf/source/20190904/C425248_6D01193C5E209F8AF6334EE5A18B2189.pdf; Supplier: LCSC; Tolerance: ±5%; Power(Watts): 62.5mW; Number of Resistors: 4; Number of Pins: 8; Temperature Coefficient: ±200ppm/℃
SW1-SW3 = PTS815SJK250SMTRLFS: 电路结构:单刀单掷-常开;按钮形状:椭圆形按钮;作用力:250gf;安装方式:立贴;触点电流:50mA;额定电压(DC):12V;; LCSC Part Name: 轻触开关; Supplier Part: C918859; Manufacturer: C&K; Supplier Footprint: SMD; JLCPCB Part Class: Extended Part; Datasheet: https://atta.szlcsc.com/upload/public/pdf/source/20190916/C411883_4F77F16E1D8E48DC707D8949CEE7CF80.pdf; Supplier: LCSC; Circuit: 单刀单掷-常开; Actuator Style: 椭圆形按钮; Operating Force: 250gf; Mounting Style: 立贴; Contact Current: 50mA; Voltage Rating (DC): 12V; IP Rating: IP40; Pin Style: J型引脚; Operating Temperature: -20℃~+70℃
C1 C2 = 0402CG180J500NT: 容值:18pF;精度:±5%;额定电压:50V;材质(温度系数):C0G;; LCSC Part Name: 18pF ±5% 50V; Supplier Part: C1549; Manufacturer: FH(风华); Supplier Footprint: 0402; JLCPCB Part Class: 基础库; Datasheet: https://atta.szlcsc.com/upload/public/pdf/source/20200305/C486355_26A10D38EF8C2A5C37091D0039909270.pdf; Supplier: LCSC; Tolerance: ±5%; Voltage Rated: 50V; Temperature Coefficient: C0G
CN1 = WAFER-100W-6A: 参考系列:-;间距:1mm;插针结构:1x6P;排数:1;每排PIN数:6;行距:-;公母:公型插针;安装方式:卧贴;额定电流:1A;工作温度范围:-25℃~+85℃;; LCSC Part Name: 间距:1mm 1x6P 卧贴; Supplier Part: C2874473; Manufacturer: HANBO(汉博); Supplier Footprint: SMD,P=1mm; JLCPCB Part Class: 扩展库; Datasheet: https://atta.szlcsc.com/upload/public/pdf/source/20221110/C17425B449CC0ADCA8915F66C4431F31.pdf; Supplier: LCSC; Pitch: 1mm; Pins Structure: 1x6P; Number of Rows: 1; Number of PINs Per Row: 6; Gender: 公型插针; Mounting Style: 卧贴; Current Rating (Max): 1A; Operating Temperature Range: -25℃~+85℃
FPC1 = FPC-05F-18PH20: 间距:0.5mm;触点数量:18P;锁定特性:翻盖式;安装类型:卧贴;触点类型:下接;工作温度范围:-25℃~+85℃;; LCSC Part Name: 0.5mm P数:18P 翻盖式 下接; Supplier Part: C2856802; Manufacturer: XUNPU(讯普); Supplier Footprint: SMD,P=0.5mm; JLCPCB Part Class: 扩展库; Datasheet: https://atta.szlcsc.com/upload/public/pdf/source/20210922/C2856802_2A845D1961F33AEC1ED22CECB292335F.pdf; Supplier: LCSC; Pitch: 0.5mm; Number of Contacts: 18P; Locking Feature: 翻盖式; Mounting Type: 卧贴; Contact Type: 下接; Height Above Board: 2mm; FFC, FCB Thickness: 0.3mm; Operating Temperature Range: -25℃~+85℃
Q1 = S8050 J3Y_C2146: 晶体管类型:NPN;集射极击穿电压(Vceo):25V;集电极电流(Ic):500mA;功率(Pd):300mW;直流电流增益(hFE@Ic,Vce):200@50mA,1V;; LCSC Part Name: NPN 耐压:25V 电流:500mA (200-350); Supplier Part: C2146; Manufacturer: CJ(江苏长电/长晶); Supplier Footprint: SOT-23; JLCPCB Part Class: 基础库; Datasheet: https://atta.szlcsc.com/upload/public/pdf/source/20140809/1457707209234.pdf; Supplier: LCSC; Transistor Type: NPN; Collector-Emitter Breakdown Voltage (Vceo): 25V; Collector Current (Ic): 500mA; Power Dissipation (Pd): 300mW; Collector Cut-Off Current (Icbo): 100nA; Collector-Emitter Saturation Voltage (VCE(sat)@Ic,Ib): 600mV@500mA,50mA; DC Current Gain (hFE@Ic,Vce): 200@50mA,1V; Transition Frequency (fT): 150MHz; Operating Temperature: +150℃@(Tj)
R1 = 0402WGF1004TCE: 电阻类型:厚膜电阻;阻值:1MΩ;精度:±1%;功率:62.5mW;温度系数:±100ppm/℃;; LCSC Part Name: 厚膜电阻 1MΩ ±1% 62.5mW; Supplier Part: C26083; Manufacturer: UNI-ROYAL(厚声); Supplier Footprint: 0402; JLCPCB Part Class: 基础库; Datasheet: https://atta.szlcsc.com/upload/public/pdf/source/20200306/C422600_1E6D84923E4A46A82E41ADD87F860B5C.pdf; Supplier: LCSC; Type: 厚膜电阻; Tolerance: ±1%; Power(Watts): 62.5mW; Temperature Coefficient: ±100ppm/℃; Overload Voltage (Max): 50V; Operating Temperature Range: -55℃~+155℃
R7 = 0402WGF100JTCE: 电阻类型:厚膜电阻;阻值:10Ω;精度:±1%;功率:62.5mW;温度系数:±200ppm/℃;; LCSC Part Name: 厚膜电阻 10Ω ±1% 62.5mW; Supplier Part: C25077; Manufacturer: UNI-ROYAL(厚声); Supplier Footprint: 0402; JLCPCB Part Class: 基础库; Datasheet: https://atta.szlcsc.com/upload/public/pdf/source/20200306/C422600_1E6D84923E4A46A82E41ADD87F860B5C.pdf; Supplier: LCSC; Type: 厚膜电阻; Tolerance: ±1%; Power(Watts): 62.5mW; Temperature Coefficient: ±200ppm/℃; Overload Voltage (Max): 50V; Operating Temperature Range: -55℃~+155℃
R8 = 0402WGF1001TCE: 电阻类型:厚膜电阻;阻值:1kΩ;精度:±1%;功率:62.5mW;; LCSC Part Name: 1kΩ ±1% 62.5mW; Supplier Part: C11702; Manufacturer: UNI-ROYAL(厚声); Supplier Footprint: 0402; JLCPCB Part Class: 基础库; Datasheet: https://atta.szlcsc.com/upload/public/pdf/source/20200306/C422600_1E6D84923E4A46A82E41ADD87F860B5C.pdf; Supplier: LCSC; Type: 厚膜电阻; Tolerance: ±1%; Power(Watts): 62.5mW; Temperature Coefficient: ±100ppm/℃; Overload Voltage (Max): 50V; Operating Temperature Range: -55℃~+155℃
SW4 SW5 = B3U-1000P: 电路结构:单刀单掷;按钮形状:圆形按钮;作用力:153gf;安装方式:立贴;开关长度:3mm;开关宽度:2.5mm;开关高度:1.6mm;触点电流:50mA;额定电压(DC):12V;带灯:-;机械寿命:-;; LCSC Part Name: 3*2.5*1.6mm 立贴 轻触开关; Supplier Part: C231329; Manufacturer: OMRON(欧姆龙); Supplier Footprint: SMD,2.5x3mm; Supplier: LCSC; Circuit: 单刀单掷; Actuator Style: 圆形按钮; Operating Force: 153gf; Mounting Style: 立贴; Switch Length: 3mm; Switch Width: 2.5mm; Switch Height: 1.6mm; Contact Current: 50mA; Voltage Rating (DC): 12V; Pin Style: SMD接片; Operating Temperature: -25℃~+70℃
TP1-TP10 = Test-Point: Test Point 测试点
U1 = GD32F303CBT6_C3013779: CPU内核:ARM Cortex-M4;CPU最大主频:120MHz;工作电压范围:-;内部振荡器:-;外部时钟频率范围:-;程序 FLASH容量:128KB;RAM总容量:32KB;EEPROM/数据 FLASH容量:-;GPIO端口数量:37;ADC(单元数/通道数/位数):2@x10ch/12bit;DAC(单元数/通道数/位数):2@x12bit;(E)PWM(单元数/通道数/位数):-;8位Timer数量:-;16位Timer数量:7;32位Timer数量:-;内部比较器数量:-;U(S)ART; LCSC Part Name: ARM Cortex-M4 120MHz 闪存：128KB RAM：32KB; Supplier Part: C3013779; Manufacturer: GigaDevice(兆易创新); Supplier Footprint: LQFP-48; JLCPCB Part Class: 扩展库; Datasheet: https://atta.szlcsc.com/upload/public/pdf/source/20220624/E1A57ED816B162D6D1424864911A792F.pdf; Supplier: LCSC; CPU Core: ARM Cortex-M4; Maximum Frequency: 120MHz; Program FLASH Size: 128KB; RAM Size: 32KB; GPIO Ports Number: 37; ADC (Units/Channels/bits): 2@x10ch/12bit; DAC (Units/Channels/bits): 2@x12bit; 16Bit Timer Number: 7; U(S)ART Number: 3; I2C Number: 2; I2S Number: 2; (Q)SPI Number: 3; CAN Number: 1; Peripherals / Functions / Protocol Stacks: 看门狗；RTC实时时钟
X1 = X32258MOB4SI: 频率:8MHz;频率公差:±10ppm;负载电容:12pF;; LCSC Part Name: 8MHz ±10ppm 12pF YSX321SL; Supplier Part: C2682775; Manufacturer: YXC(扬兴晶振); Supplier Footprint: SMD3225-4P; JLCPCB Part Class: 扩展库; Datasheet: https://atta.szlcsc.com/upload/public/pdf/source/20210106/C2682774_0CD4FDA5D9DA3FBEEC23BD607A48E4B0.pdf; Supplier: LCSC; Crystal Type: 贴片无源晶振; Frequency Tolerance: ±10ppm; Frequency Stability: ±30ppm; Load Capacitance: 12pF; Equivalent Series Resistance (ESR): 150Ω; Operating Temperature: -40℃~+85℃
C117 C148-C150 C160 C161 = GRM188R61A226ME15D: 容值:22uF;精度:±20%;额定电压:10V;材质(温度系数):X5R;; LCSC Part Name: 22uF ±20% 10V; Supplier Part: C84419; Manufacturer: muRata(村田); Supplier Footprint: 0603; JLCPCB Part Class: 扩展库; Datasheet: https://atta.szlcsc.com/upload/public/pdf/source/20161024/1477288637384.pdf; Supplier: LCSC; Tolerance: ±20%; Voltage Rated: 10V; Temperature Coefficient: X5R
C126 C130 C151-C153 C162 C163 C180 C187 C194 = CL10A106KP8NNNC: 容值:10uF;精度:±10%;额定电压:10V;材质(温度系数):X5R;; LCSC Part Name: 10uF ±10% 10V; Supplier Part: C19702; Manufacturer: SAMSUNG(三星); Supplier Footprint: 0603; JLCPCB Part Class: 基础库; Datasheet: https://atta.szlcsc.com/upload/public/pdf/source/20160103/1457707703378.pdf; Supplier: LCSC; Tolerance: ±10%; Voltage Rated: 10V; Temperature Coefficient: X5R
C127 C131 = 0402B102K500NT: 容值:1nF;精度:±10%;额定电压:50V;材质(温度系数):X7R;; LCSC Part Name: 1nF ±10% 50V; Supplier Part: C1523; Manufacturer: FH(风华); Supplier Footprint: 0402; JLCPCB Part Class: 基础库; Datasheet: https://atta.szlcsc.com/upload/public/pdf/source/20200305/C486355_26A10D38EF8C2A5C37091D0039909270.pdf; Supplier: LCSC; Tolerance: ±10%; Voltage Rated: 50V; Temperature Coefficient: X7R
C174 C179 C181 C186 C188 C193 = CC0603KRX7R9BB104: 容值:100nF;精度:±10%;额定电压:50V;材质(温度系数):X7R;; LCSC Part Name: 100nF ±10% 50V; Supplier Part: C14663; Manufacturer: YAGEO(国巨); Supplier Footprint: 0603; JLCPCB Part Class: Basic Part; Datasheet: https://atta.szlcsc.com/upload/public/pdf/source/20170116/1484561234239.pdf; Supplier: LCSC; Tolerance: ±10%; Voltage Rated: 50V; Temperature Coefficient: X7R
C175 C176 C182 C183 C189 C190 = CL05B104KB54PNC: 容值:100nF;精度:±10%;额定电压:50V;材质(温度系数):X7R;; LCSC Part Name: 100nF ±10% 50V; Supplier Part: C307331; Manufacturer: SAMSUNG(三星); Supplier Footprint: 0402; JLCPCB Part Class: 基础库; Datasheet: https://atta.szlcsc.com/upload/public/pdf/source/20181009/C307331_222F7C870FD3EA5F46F538B483443886.pdf; Supplier: LCSC; Tolerance: ±10%; Voltage Rated: 50V; Temperature Coefficient: X7R
C177 C184 C191 = 0402CG220J500NT: 容值:22pF;精度:±5%;额定电压:50V;材质(温度系数):C0G;; LCSC Part Name: 22pF ±5% 50V; Supplier Part: C1555; Manufacturer: FH(风华); Supplier Footprint: 0402; JLCPCB Part Class: Basic Part; Datasheet: https://atta.szlcsc.com/upload/public/pdf/source/20170923/C1555_1506149269156988362.pdf; Supplier: LCSC; Tolerance: ±5%; Voltage Rated: 50V; Temperature Coefficient: C0G
C178 C185 C192 = CL10A226MQ8NRNC: 容值:22uF;精度:±20%;额定电压:6.3V;材质(温度系数):X5R;; LCSC Part Name: 22uF ±20% 6.3V; Supplier Part: C59461; Manufacturer: SAMSUNG(三星); Supplier Footprint: 0603; JLCPCB Part Class: Basic Part; Datasheet: https://atta.szlcsc.com/upload/public/pdf/source/20160103/1457707740762.pdf; Supplier: LCSC; Tolerance: ±20%; Voltage Rated: 6.3V; Temperature Coefficient: X5R
L2 L17 L18 = MWSA0402S-3R3MT: 额定电流:3.3A;精度:±20%;电感值:3.3uH;直流电阻(DCR):87mΩ;; LCSC Part Name: 3.3uH ±20%; Supplier Part: C408336; Manufacturer: Sunlord(顺络); Supplier Footprint: SMD; JLCPCB Part Class: Extended Part; Datasheet: https://atta.szlcsc.com/upload/public/pdf/source/20190729/C408336_17B5BB1DF2845DE8F323BD9CE9EEFEBA.pdf; Supplier: LCSC; Height: 2mm; Rated Current: 3.3A; Width: 4.4mm; Tolerance: ±20%; DC Resistance (DCR): 87mΩ; Length: 4.2mm
L12 L13 = UPZ1005D121-1R3TF: 标称阻抗@测试频率:120Ω@100MHz;误差:±25%;直流电阻(RDC):90mΩ;; LCSC Part Name: 单路 0402磁珠 阻抗120Ω@100MHz; Supplier Part: C96993; Manufacturer: Sunlord(顺络); Supplier Footprint: 0402; JLCPCB Part Class: 扩展库; Datasheet: https://atta.szlcsc.com/upload/public/pdf/source/20210916/3C06D8971A361A4569490E57F6B8A429.pdf; Supplier: LCSC; Impedance @ Frequency: 120Ω@100MHz; Tolerance: ±25%; DC Resistance: 90mΩ; Current Rating: 1.3A; Circuits: 1
R36 R157 R161 = 0402WGF4702TCE: 电阻类型:厚膜电阻;阻值:47kΩ;精度:±1%;功率:62.5mW;; LCSC Part Name: 47kΩ ±1% 62.5mW; Supplier Part: C25792; Manufacturer: UNI-ROYAL(厚声); Supplier Footprint: 0402; JLCPCB Part Class: Basic Part; Datasheet: https://atta.szlcsc.com/upload/public/pdf/source/20200306/C422600_1E6D84923E4A46A82E41ADD87F860B5C.pdf; Supplier: LCSC; Type: 厚膜电阻; Tolerance: ±1%; Power(Watts): 62.5mW; Temperature Coefficient: ±100ppm/℃; Overload Voltage (Max): 50V; Operating Temperature Range: -55℃~+155℃
R37 = 0402WGF1502TCE: 电阻类型:厚膜电阻;阻值:15kΩ;精度:±1%;功率:62.5mW;最大工作电压:50V;温度系数:±100ppm/℃;; LCSC Part Name: 15kΩ ±1% 62.5mW 厚膜电阻; Supplier Part: C25756; Manufacturer: UNI-ROYAL(厚声); Supplier Footprint: 0402; JLCPCB Part Class: 基础库; Datasheet: https://atta.szlcsc.com/upload/public/pdf/source/20200306/C422600_1E6D84923E4A46A82E41ADD87F860B5C.pdf; Supplier: LCSC; Type: 厚膜电阻; Tolerance: ±1%; Power(Watts): 62.5mW; Overload Voltage (Max): 50V; Temperature Coefficient: ±100ppm/℃; Operating Temperature Range: -55℃~+155℃
R40 = 0402WGF3301TCE: 电阻类型:厚膜电阻;阻值:3.3kΩ;精度:±1%;功率:62.5mW;最大工作电压:50V;温度系数:±100ppm/℃;; LCSC Part Name: 3.3kΩ ±1% 62.5mW 厚膜电阻; Supplier Part: C25890; Manufacturer: UNI-ROYAL(厚声); Supplier Footprint: 0402; JLCPCB Part Class: 基础库; Datasheet: https://atta.szlcsc.com/upload/public/pdf/source/20200306/C422600_1E6D84923E4A46A82E41ADD87F860B5C.pdf; Supplier: LCSC; Type: 厚膜电阻; Tolerance: ±1%; Power(Watts): 62.5mW; Overload Voltage (Max): 50V; Temperature Coefficient: ±100ppm/℃; Operating Temperature Range: -55℃~+155℃
R103 R104 = 0402WGF5101TCE: 电阻类型:厚膜电阻;阻值:5.1kΩ;精度:±1%;功率:62.5mW;温度系数:±100ppm/℃;; LCSC Part Name: 厚膜电阻 5.1kΩ ±1% 62.5mW; Supplier Part: C25905; Manufacturer: UNI-ROYAL(厚声); Supplier Footprint: 0402; JLCPCB Part Class: 基础库; Datasheet: https://atta.szlcsc.com/upload/public/pdf/source/20200306/C422600_1E6D84923E4A46A82E41ADD87F860B5C.pdf; Supplier: LCSC; Type: 厚膜电阻; Tolerance: ±1%; Power(Watts): 62.5mW; Temperature Coefficient: ±100ppm/℃; Overload Voltage (Max): 50V; Operating Temperature Range: -55℃~+155℃
R156 R158 R162 = RC0402FR-0730KL: 电阻类型:厚膜电阻;阻值:30kΩ;精度:±1%;功率:62.5mW;; LCSC Part Name: 30kΩ ±1% 62.5mW; Supplier Part: C138008; Manufacturer: YAGEO(国巨); Supplier Footprint: 0402; JLCPCB Part Class: Extended Part; Datasheet: https://atta.szlcsc.com/upload/public/pdf/source/20171107/C138008_15100516356731096935.pdf; Supplier: LCSC; Type: 厚膜电阻; Tolerance: ±1%; Power(Watts): 62.5mW; Temperature Coefficient: ±100ppm/℃; Overload Voltage (Max): 50V; Operating Temperature Range: -55℃~+155℃
R163 R165 = 0402WGF1202TCE: 电阻类型:厚膜电阻;阻值:12kΩ;精度:±1%;功率:62.5mW;最大工作电压:50V;温度系数:±100ppm/℃;; LCSC Part Name: 12kΩ ±1% 62.5mW 厚膜电阻; Supplier Part: C25752; Manufacturer: UNI-ROYAL(厚声); Supplier Footprint: 0402; JLCPCB Part Class: 基础库; Datasheet: https://atta.szlcsc.com/upload/public/pdf/source/20200306/C422600_1E6D84923E4A46A82E41ADD87F860B5C.pdf; Supplier: LCSC; Type: 厚膜电阻; Tolerance: ±1%; Power(Watts): 62.5mW; Overload Voltage (Max): 50V; Temperature Coefficient: ±100ppm/℃; Operating Temperature Range: -55℃~+155℃
R164 R166 = RC0402FR-0718KL: 电阻类型:厚膜电阻;阻值:18kΩ;精度:±1%;功率:62.5mW;最大工作电压:50V;温度系数:±100ppm/℃;; LCSC Part Name: 厚膜电阻 18kΩ ±1% 62.5mW; Supplier Part: C138044; Manufacturer: YAGEO(国巨); Supplier Footprint: 0402; JLCPCB Part Class: 扩展库; Datasheet: https://atta.szlcsc.com/upload/public/pdf/source/20181009/C309620_DA5935B6E1D48212CB7A533FE518B3C2.pdf; Supplier: LCSC; Type: 厚膜电阻; Tolerance: ±1%; Power(Watts): 62.5mW; Overload Voltage (Max): 50V; Temperature Coefficient: ±100ppm/℃; Operating Temperature Range: -55℃~+155℃
R177 = 0402WGF1501TCE: 电阻类型:厚膜电阻;阻值:1.5kΩ;精度:±1%;功率:62.5mW;温度系数:±100ppm/℃;; LCSC Part Name: 厚膜电阻 1.5kΩ ±1% 62.5mW; Supplier Part: C25867; Manufacturer: UNI-ROYAL(厚声); Supplier Footprint: 0402; JLCPCB Part Class: 基础库; Datasheet: https://atta.szlcsc.com/upload/public/pdf/source/20200306/C422600_1E6D84923E4A46A82E41ADD87F860B5C.pdf; Supplier: LCSC; Type: 厚膜电阻; Tolerance: ±1%; Power(Watts): 62.5mW; Temperature Coefficient: ±100ppm/℃; Overload Voltage (Max): 50V; Operating Temperature Range: -55℃~+155℃
U2 U31 U32 = SY8113BADC: 功能类型:降压型;同步整流:-;输出通道数:-;拓扑结构:-;输入电压:-;输出电流(最大值):-;开关频率:-;; LCSC Part Name: 降压型; Supplier Part: C78989; Manufacturer: silergy(矽力杰); Supplier Footprint: TSOT-23-6; JLCPCB Part Class: Extended Part; Datasheet: https://atta.szlcsc.com/upload/public/pdf/source/20161125/1480067827505.pdf; Supplier: LCSC; Function: 降压型
USB2 = TYPE-C 16PIN 2MD(073): 连接器类型:Type-C;标准:-;公母:母座;触点数量:16;端口数量:1;安装方式:卧贴;额定电流 - 电源:5A;工作温度范围:-25℃~+85℃;; LCSC Part Name: TYPE-C母座 16P 4脚插件带定位柱 不锈钢外壳 2次模顶; Supplier Part: C2765186; Manufacturer: SHOU HAN(首韩); Supplier Footprint: SMD; JLCPCB Part Class: 扩展库; Supplier: LCSC; Connector Type: Type-C; Gender: 母座; Number of Contacts: 16; Number of Ports: 1; Mounting Style: 卧贴; Current Rating - Power (Max): 5A; Operating Temperature Range: -25℃~+85℃

## Nets
+1.0V: C148.2 C149.2 C150.2 C151.2 C152.2 C153.2 C154.2 C155.2 C156.2 C157.2 C158.2 C159.2 C191.2 C192.2 C193.2 L12.1 L13.1 L18.2 R163.2 U7.A1(1) U7.A16(16) U7.G7(103) U7.K10(154) U7.T1(241) U7.T16(256)
+1.5V: C27.2 C91.2 C92.2 C144.2 C145.2 C146.2 C147.2 C184.2 C185.2 C186.2 L17.2 R166.2 U7.D5(53) U7.E4(68) U7.H7(119) U7.J7(135) U7.M4(180) ; also on sheet 6 7
+3.3V: C22.2 C114.2 C115.2 C116.2 C123.2 C124.2 C143.2 C160.2 C161.2 C162.2 C163.2 C164.2 C165.2 C168.2 C169.2 C170.2 C173.2 C177.2 C178.2 C179.2 FPC1.10 H5.38 H6.38 L2.2 LED1.2(+) LED2.2(+) LED3.2(+) LED6.3(COM) LED6.8(COM) R2.2 R6.2 R7.2 R37.2 R61.2 R136.1 R137.1 R138.1 R178.2 SW5.2 U1.1(VBAT) U1.9(VDDA) U1.24(VDD_1) U1.36(VDD_2) U1.48(VDD_3) U7.D12(60) U7.E13(77) U7.G8(104) U7.G9(105) U7.H10(122) U7.J10(138) U7.K8(152) U7.K9(153) U7.M13(189) U7.N5(197) U7.N12(204) ; also on sheet 7 8 9 10
+5V_IN: C117.2 C118.2 C171.2 C174.2 C180.2 C181.2 C187.2 C188.2 C194.2 CN1.6 D8.2 H5.40 H6.40 R36.2 R157.2 R161.2 U2.5(IN) U31.5(IN) U32.5(IN) USB2.2(VBUS) USB2.11(VBUS) ; also on sheet 8 9
GND: C1.2 C2.1 C22.1 C27.1 C72.2 C73.2 C91.1 C92.1 C114.1 C115.1 C116.1 C117.1 C118.1 C123.1 C124.1 C126.1 C127.1 C128.1 C130.1 C131.1 C132.1 C143.1 C144.1 C145.1 C146.1 C147.1 C148.1 C149.1 C150.1 C151.1 C152.1 C153.1 C154.1 C155.1 C156.1 C157.1 C158.1 C159.1 C160.1 C161.1 C162.1 C163.1 C164.1 C165.1 C167.1 C168.1 C169.1 C170.1 C171.1 C172.1 C173.1 C174.1 C175.1 C178.1 C179.1 C180.1 C181.1 C182.1 C185.1 C186.1 C187.1 C188.1 C189.1 C192.1 C193.1 C194.1 CN1.3 D6.1 D7.1 D8.1 D12.1 E1.1 E2.1 FPC1.11 FPC1.18 H1.1 H2.1 H3.1 H4.1 H5.37 H5.39 H6.37 H6.39 NC1.1 Q1.2(E) R4.1 R9.2 R40.1 R103.2 R104.2 R133.2 R134.2 R135.2 R156.1 R158.1 R162.1 R164.1 R165.1 SW1.3 SW1.4 SW2.3 SW2.4 SW3.3 SW3.4 SW4.1 U1.8(VSSA) U1.23(VSS_1) U1.35(VSS_2) U1.47(VSS_3) U2.2(GND) U7.B2(18) U7.B15(31) U7.C3(35) U7.C14(46) U7.D4(52) U7.D13(61) U7.E5(69) U7.E12(76) U7.F6(86) U7.F11(91) U7.H8(120) U7.H9(121) U7.J8(136) U7.J9(137) U7.L6(166) U7.L11(171) U7.M5(181) U7.M12(188) U7.N4(196) U7.N13(205) U7.P3(211) U7.P14(222) U7.R2(226) U7.R15(239) U31.2(GND) U32.2(GND) USB2.1(GND) USB2.12(GND) USB2.13(SHELL) USB2.14(SHELL) X1.2(GND) X1.4(GND) ; also on sheet 6 7 8 9 10
VCCPLLL: C126.2 C127.2 C128.2 L12.2 U7.G10(106)
VCCPLLR: C130.2 C131.2 C132.2 L13.2 U7.K7(151)
A13_IOR32A_READY: R137.2 U7.A13(IOR32A/READY)
B10_IOR31B_RECFG: R136.2 U7.B10(IOR31B/RECONFIG_N)
B16_MODE1: R133.1 U7.B16(IOR30B/MODE1)
BOOT0: R4.2 SW5.1 U1.44(BOOT0)
C10_IOR39A: R172.2 U7.C10(IOR39A/SCLK)
C13_IOR32B_DONE: R138.2 U7.C13(IOR32B/DONE)
C15_MODE2: R134.1 U7.C15(IOR31A/MODE2)
D11_IOL22A: C72.1 D6.2 R61.1 SW2.1 SW2.2 U7.D11(IOL22A)
D14_IOT44A: TP4.1 U1.13(PA3) U7.D14(IOT44A)
DDR3_A0: U7.F7(IOL45A/LPLL2_T_in) ; also on sheet 6
DDR3_A1: U7.A4(IOB2A) ; also on sheet 6
DDR3_A2: U7.D6(IOB3A) ; also on sheet 6
DDR3_A3: U7.F8(IOL35A) ; also on sheet 6
DDR3_A4: U7.C4(IOL47A/LPLL2_T_fb) ; also on sheet 6
DDR3_A5: U7.E6(IOL53A) ; also on sheet 6
DDR3_A6: U7.B1(IOB8A) ; also on sheet 6
DDR3_A7: U7.D8(IOL38A) ; also on sheet 6
DDR3_A8: U7.A5(IOB7A) ; also on sheet 6
DDR3_A9: U7.F9(IOL31A) ; also on sheet 6
DDR3_A10: U7.K3(IOB36A) ; also on sheet 6
DDR3_A11: U7.B7(IOL40A) ; also on sheet 6
DDR3_A12: U7.A3(IOB4A) ; also on sheet 6
DDR3_A13: U7.C8(IOL29A/GCLKT_6) ; also on sheet 6
DDR3_BA0: U7.H4(IOB26A) ; also on sheet 6
DDR3_BA1: U7.D3(IOB9A) ; also on sheet 6
DDR3_BA2: U7.H5(IOB35A) ; also on sheet 6
DDR3_CASN: U7.R6(IOB54A) ; also on sheet 6
DDR3_CK_EN: U7.J2(IOB34A) ; also on sheet 6
DDR3_CKN: U7.J3(IOB27B/GCLKC_5) ; also on sheet 6
DDR3_CKP: U7.J1(IOB27A/GCLKT_5) ; also on sheet 6
DDR3_CSN: U7.P5(IOB50A) ; also on sheet 6
DDR3_DQ0: U7.G5(IOB20A) ; also on sheet 6
DDR3_DQ1: U7.F5(IOB22A) ; also on sheet 6
DDR3_DQ2: U7.F4(IOB18A) ; also on sheet 6
DDR3_DQ3: U7.F3(IOB19A) ; also on sheet 6
DDR3_DQ4: U7.E2(IOB12A) ; also on sheet 6
DDR3_DQ5: U7.C1(IOB14A) ; also on sheet 6
DDR3_DQ6: U7.E1(IOB16A) ; also on sheet 6
DDR3_DQ7: U7.B3(IOB13A) ; also on sheet 6
DDR3_DQ8: U7.M3(IOB42A) ; also on sheet 6
DDR3_DQ9: U7.K4(IOB39A) ; also on sheet 6
DDR3_DQ10: U7.N2(IOB41A) ; also on sheet 6
DDR3_DQ11: U7.L1(IOB38A) ; also on sheet 6
DDR3_DQ12: U7.P4(IOB45A) ; also on sheet 6
DDR3_DQ13: U7.H3(IOB32A) ; also on sheet 6
DDR3_DQ14: U7.R1(IOB44A) ; also on sheet 6
DDR3_DQ15: U7.M2(IOB43A) ; also on sheet 6
DDR3_LDM: U7.G1(IOB24A) ; also on sheet 6
DDR3_LDQSN: U7.G3(IOB21B) ; also on sheet 6
DDR3_LDQSP: U7.G2(IOB21A) ; also on sheet 6
DDR3_ODT: U7.R3(IOB48A) ; also on sheet 6
DDR3_RASN: U7.R4(IOB52A) ; also on sheet 6
DDR3_RSTN: U7.B9(IOL33A) ; also on sheet 6
DDR3_UDM: U7.K5(IOB40A) ; also on sheet 6
DDR3_UDQSN: U7.K6(IOB37B) ; also on sheet 6
DDR3_UDQSP: U7.J5(IOB37A) ; also on sheet 6
DDR3_WEN: U7.L2(IOB30A/GCLKT_4) ; also on sheet 6
E15_IOT44B: TP5.1 U1.14(PA4) U7.E15(IOT44B)
EX_IOL2A_B14: H5.17 U7.B14(IOL2A)
EX_IOL2B_A15: H5.18 U7.A15(IOL2B)
EX_IOL7A_C12: H5.22 U7.C12(IOL7A/LPLL1_T_in)
EX_IOL7B_B12: H5.21 U7.B12(IOL7B/LPLL1_C_in)
EX_IOL8A_B13: H5.15 U7.B13(IOL8A/LPLL1_T_fb)
EX_IOL8B_A14: H5.16 U7.A14(IOL8B/LPLL1_C_fb)
EX_IOL13A_B11: H5.20 U7.B11(IOL13A)
EX_IOL13B_A12: H5.19 U7.A12(IOL13B)
EX_IOL15A_A11: H5.24 U7.A11(IOL15A)
EX_IOL15B_C11: H5.23 U7.C11(IOL15B)
EX_IOL17A_D10: H5.28 U7.D10(IOL17A)
EX_IOL17B_E10: H5.27 U7.E10(IOL17B)
EX_IOL27A_A9: H5.26 U7.A9(IOL27A/GCLKT_7)
EX_IOL27B_C9: H5.25 U7.C9(IOL27B/GCLKC_7)
EX_IOR7A_T15: H5.36 U7.T15(IOR7A/RPLL1_T_in)
EX_IOR7B_R14: H5.35 U7.R14(IOR7B/RPLL1_C_in)
EX_IOR8A_P12: H5.31 U7.P12(IOR8A/RPLL1_T_fb)
EX_IOR8B_T13: H5.33 U7.T13(IOR8B/RPLL1_C_fb)
EX_IOR24A_T11: H5.34 U7.T11(IOR24A)
EX_IOR24B_P11: H5.32 U7.P11(IOR24B)
EX_IOR27A_N10: H5.29 U7.N10(IOR27A/GCLKT_2)
EX_IOR27B_M11: H5.30 U7.M11(IOR27B/GCLKC_2)
EX_IOR29B_R8: H6.22 U7.R8(IOR29B/GCLKC_3)
EX_IOR36A_M8: H6.16 U7.M8(IOR36A/SO/D1)
EX_IOR36B_N9: H6.14 U7.N9(IOR36B/SSPI_CS_N/D0)
EX_IOR38A_T9: H6.23 U7.T9(IOR38A/DIN/CLKHOLD_N)
EX_IOR38B_P9: H6.24 U7.P9(IOR38B/DOUT/WE_N)
EX_IOR40A_N8: H6.20 U7.N8(IOR40A)
EX_IOR40B_L9: H6.11 U7.L9(IOR40B)
EX_IOR42A_P8: H6.26 U7.P8(IOR42A)
EX_IOR42B_T8: H6.25 U7.T8(IOR42B)
EX_IOR44A_M6: H6.15 U7.M6(IOR44A)
EX_IOR44B_L8: H6.13 U7.L8(IOR44B)
EX_IOR47A_M7: H6.17 U7.M7(IOR47A/RPLL2_T_fb)
EX_IOR47B_N7: H6.19 U7.N7(IOR47B/RPLL2_C_fb)
EX_IOR53A_P6: H6.21 U7.P6(IOR53A)
EX_IOR53B_T6: H6.18 U7.T6(IOR53B)
EX_IOT2A_L15: R177.2 U7.L15(IOT2A)
EX_IOT4A_D16: H5.13 U7.D16(IOT4A)
EX_IOT4B_E14: H5.14 U7.E14(IOT4B)
EX_IOT5A_C16: H5.11 U7.C16(IOT5A)
EX_IOT5B_D15: H5.12 U7.D15(IOT5B)
EX_IOT6A_E16: H5.9 U7.E16(IOT6A)
EX_IOT6B_F15: H5.10 U7.F15(IOT6B)
EX_IOT9A_F14: H5.5 U7.F14(IOT9A)
EX_IOT9B_F16: H5.6 U7.F16(IOT9B)
EX_IOT13A_G15: H6.7 U7.G15(IOT13A)
EX_IOT13B_G14: H6.8 U7.G14(IOT13B)
EX_IOT16A_G16: H6.9 U7.G16(IOT16A)
EX_IOT16B_H15: H6.10 U7.H15(IOT16B)
EX_IOT22A_J16: H5.4 U7.J16(IOT22A)
EX_IOT22B_J14: H5.3 U7.J14(IOT22B)
EX_IOT24A_J15: H5.2 U7.J15(IOT24A)
EX_IOT24B_K16: H5.1 U7.K16(IOT24B)
EX_IOT27A_H11: H5.8 U7.H11(IOT27A/GCLKT_0)
EX_IOT27B_J13: H5.7 U7.J13(IOT27B/GCLKC_0)
EX_IOT30A_K14: H6.27 U7.K14(IOT30A/GCLKT_1)
EX_IOT30B_K15: H6.28 U7.K15(IOT30B/GCLKC_1)
EX_IOT36A_K13: H6.29 U7.K13(IOT36A)
EX_IOT36B_K12: H6.30 U7.K12(IOT36B)
EX_IOT48A_N15: H6.31 U7.N15(IOT48A)
EX_IOT48B_P16: H6.32 U7.P16(IOT48B)
EX_IOT52A_N16: H6.35 U7.N16(IOT52A)
EX_IOT52B_N14: H6.36 U7.N14(IOT52B)
EX_IOT54A_P15: H6.33 U7.P15(IOT54A)
EX_IOT54B_R16: H6.34 U7.R16(IOT54B)
EX_PA11: H6.2 U1.32(PA11)
EX_PA12: H6.1 U1.33(PA12)
EX_PB0: H6.5 U1.18(PB0)
EX_PB9: H6.6 U1.46(PB9)
EX_PB10: H6.4 U1.21(PB10)
EX_PB11: H6.3 U1.22(PB11)
F10_IOL11A: C73.1 D7.2 R178.1 SW3.1 SW3.2 U7.F10(IOL11A)
F12_IOT12A_FPGA_TX: U7.F12(IOT12A) ; also on sheet 8
F13_IOT8A_FPGA_RX: U7.F13(IOT8A) ; also on sheet 8
G11_IOT14A: RN4.4 U7.G11(IOT14A)
G12_IOT8B: RN4.3 U7.G12(IOT8B)
G13_IOT12B: RN4.2 U7.G13(IOT12B)
H12_IOT14B: RN5.7 U7.H12(IOT14B)
H13_IOT18A: RN5.6 U7.H13(IOT18A)
H14_IOT20A: RN5.5 U7.H14(IOT20A)
H16_IOT20B: RN4.1 U7.H16(IOT20B)
J11_IOT32A: TP2.1 U1.11(PA1) U7.J11(IOT32A)
J12_IOT18B: TP1.1 U1.10(PA0-WKUP) U7.J12(IOT18B)
JTAG_TCK: U7.A7(IOR26A/TCK) ; also on sheet 8
JTAG_TDI: U7.A6(IOR26B/TDI) ; also on sheet 8
JTAG_TDO: U7.C6(IOR25A/TDO) ; also on sheet 8
JTAG_TMS: U7.B8(IOR25B/TMS) ; also on sheet 8
K11_IOT38A: TP3.1 U1.12(PA2) U7.K11(IOT38A)
L10_IOR34B_FLASH_SPI_CLK: U7.L10(IOR34B/MCLK/D4) ; also on sheet 8
L12_IOT32B: TP6.1 U1.15(PA5) U7.L12(IOT32B)
L13_IOT38B: TP7.1 U1.16(PA6) U7.L13(IOT38B)
L14_IOT34B: RN5.8 U7.L14(IOT34B)
L16_IOT34A: TP8.1 U1.17(PA7) U7.L16(IOT34A)
LCD_BLK: R8.2 U1.19(PB1)
LCD_CS: FPC1.14 U1.25(PB12)
LCD_DC: FPC1.15 U1.2(PC13-TAMPER-RTC)
LCD_MISO: FPC1.12 U1.27(PB14)
LCD_MOSI: FPC1.13 U1.28(PB15)
LCD_RST: FPC1.17 U1.20(PB2)
LCD_SCK: FPC1.16 U1.26(PB13)
LVDS_IOR11_N: U7.P13(IOR11B) ; also on sheet 9
LVDS_IOR11_P: U7.R12(IOR11A) ; also on sheet 9
LVDS_IOR17_N: U7.T12(IOR17B) ; also on sheet 9
LVDS_IOR17_P: U7.R11(IOR17A) ; also on sheet 9
LVDS_IOR20_N: U7.T14(IOR20B) ; also on sheet 9
LVDS_IOR20_P: U7.R13(IOR20A) ; also on sheet 9
LVDS_IOR22_N: U7.N11(IOR22B) ; also on sheet 9
LVDS_IOR22_P: U7.M10(IOR22A) ; also on sheet 9
M9_IOR34A_FLASH_SPI_CS: U7.M9(IOR34A/MCS_N/D5) ; also on sheet 8
M14_IOT40A: E2.2 R177.1 U7.M14(IOT40A) USB2.6(DP1) USB2.8(DP2)
M15_IOT40B: E1.2 U7.M15(IOT40B) USB2.5(DN2) USB2.7(DN1)
M16_MODE0: R135.1 U7.M16(IOR30A/MODE0)
N6_IOR51A: R173.1 U7.N6(IOR51A)
NRST: C167.2 R2.1 SW4.2 U1.7(NRST)
OSCIN: C1.1 R1.2 U1.5(PD0-OSCIN) X1.3
OSCOUT: C2.2 R1.1 U1.6(PD1-OSCOUT) X1.1
P7_IOR49B: R174.2 U7.P7(IOR49B)
P10_IOR33A_FLASH_SPI_SO: U7.P10(IOR33A/MI/D7) ; also on sheet 8
PA8: C172.2 D12.2 R6.1 SW1.1 SW1.2 U1.29(PA8)
PA9/USART0_TX: CN1.1 U1.30(PA9)
PA10/USART0_RX: CN1.2 U1.31(PA10)
PA13/SWDIO: CN1.4 TP9.1 U1.34(PA13)
PA14/SWCLK: CN1.5 TP10.1 U1.37(PA14)
PA15/SPI2_NSS: U1.38(PA15) ; also on sheet 10
PB3/SPI2_SCK: U1.39(PB3) ; also on sheet 10
PB4/SPI2_MISO: U1.40(PB4) ; also on sheet 10
PB5/SPI2_MOSI: U1.41(PB5) ; also on sheet 10
PB6: R169.2 U1.42(PB6)
PB7: R167.1 U1.43(PB7)
PB8: R168.2 U1.45(PB8)
R7_IOR49A: R171.2 U7.R7(IOR49A)
R9_IOR35A: R170.1 U7.R9(IOR35A/FASTRD_N/D3)
R10_IOR33B_FLASH_SPI_SI: U7.R10(IOR33B/MO/D6) ; also on sheet 8
T7_IOR29A_OSC50M: U7.T7(IOR29A/GCLKT_3) ; also on sheet 8
T10_IOR35B: R175.2 U7.T10(IOR35B/SI/D2)
$1N8016: R9.1 U7.L7(EXTR)
$2N4063: FPC1.9 R7.1
$2N4170: FPC1.5 FPC1.6 FPC1.7 FPC1.8 Q1.3(C)
$2N4261: NC1.2 Q1.1(B) R8.1
$2N29758: LED1.4(-) R167.2
$2N29834: LED1.1(-) R168.1
$2N29910: LED1.3(-) R169.1
$5N120357: LED6.6(B) RN4.8
$5N120358: LED6.7(A) RN4.7
$5N120359: LED6.9(F) RN4.6
$5N120360: LED6.10(G) RN4.5
$5N120361: LED6.5(DP) RN5.1
$5N120362: LED6.4(C) RN5.2
$5N120363: LED6.2(D) RN5.3
$5N120364: LED6.1(E) RN5.4
$5N123844: LED2.4(-) R170.2
$5N123846: LED2.1(-) R171.1
$5N123848: LED2.3(-) R172.1
$5N124020: LED3.4(-) R173.2
$5N124022: LED3.1(-) R174.1
$5N124024: LED3.3(-) R175.1
$6N7183: R103.1 USB2.10(CC2)
$6N7711: R104.1 USB2.4(CC1)
$6N79710: C176.2 U2.1(BS)
$6N79711: C176.1 L2.1 U2.6(LX)
$6N79712: C177.1 R37.1 R40.2 U2.3(FB)
$6N79718: C175.2 R36.1 R156.2 U2.4(EN)
$6N80321: C182.2 R157.1 R158.2 U31.4(EN)
$6N80325: C184.1 R165.2 R166.1 U31.3(FB)
$6N80326: C183.2 U31.1(BS)
$6N80327: C183.1 L17.1 U31.6(LX)
$6N80929: C189.2 R161.1 R162.2 U32.4(EN)
$6N80934: C191.1 R163.1 R164.2 U32.3(FB)
$6N80935: C190.2 U32.1(BS)
$6N80936: C190.1 L18.1 U32.6(LX)

Not connected (* = marked no-connect by the designer): CN1 7* 8*; FPC1 1* 2* 3* 4* 19* 20*; H6 12*; U1 3(PC14-OSC32IN)* 4(PC15-OSC32OUT)*; U7 A2(IOB13B)* A8(IOL29B/GCLKC_6)* A10(IOL33B)* B4(IOB4B)* B5(IOL47B/LPLL2_C_fb)* B6(IOB7B)* C2(IOB8B)* C5(IOB2B)* C7(IOL40B)* D1(IOB9B)* D2(IOB14B)* D7(IOL53B)* D9(IOL35B)* E3(IOB12B)* E7(IOB3B)* E8(IOL45B/LPLL2_C_in)* E9(IOL38B)* E11(IOL31B)* F1(IOB19B)* F2(IOB16B)* G4(IOB20B)* G6(IOB18B)* H1(IOB32B)* H2(IOB24B)* H6(IOB22B)* J4(IOB35B)* J6(IOB26B)* K1(IOB34B)* K2(IOB36B)* L3(IOB38B)* L4(IOB40B)* L5(IOB39B)* M1(IOB30B/GCLKC_4)* N1(IOB42B)* N3(IOB43B)* P1(IOB41B)* P2(IOB44B)* R5(IOB50B)* T2(IOB48B)* T3(IOB52B)* T4(IOB45B)* T5(IOB54B)*; USB2 3(SBU2)* 9(SBU1)*

## Notes on the sheets
sheet 1
- 这个要引出来
- SD卡
- 全等长
- CAN 485   OV2640
- PT8211   做音频
- R8    C10互换
- MS5351时钟
- RGB888
- 引出
  TX一组等长
  RX一组等长
  可以跨层
- 网口
  R8为网口时钟必须
- GW2A-LV18PG256C8/I7
sheet 2
- 晶振电路
- DAPLINK
- 红
- 绿
- 蓝
- GD32F303CBT6
- RGB灯
- 复位&启动电路
- 与FPGA交互引脚
- 功能按键
- 2.4寸TFT-SPI
sheet 3
- USB HOST     USBDM,USBDP
  TIME0_CH3    CAN0_TX   CAN0_RX
- 3V3
- 硬件 IIC
- ADC1_IN8
- TIME3-CH3   TIME10-CH0
- usb  复用
- LVDS
- 重要事情说三遍！！！
- 重要事情说三遍！！！
- 只允许5V输入 3V3输出
- 只允许5V输入 3V3输出
- 只允许5V输入 3V3输出
- 只允许5V输入 3V3输出
- 只允许5V输入 3V3输出
- 只允许5V输入 3V3输出
- 输入保护电路
- 拓展排针接口
sheet 4
- 红
- 绿
- 蓝
- 红
- 绿
- 蓝
- LED&&按键&&数码管
sheet 5
- TYPE-16P
- BANK0
- BANK2&3
- BANK1
- BANK7
- BANK5&6
- BANK4
- FPGA主电源滤波
- 后续请勿更新库，相关管脚会修改。
- 后续请勿更新库，相关管脚会修改。
- Vout = 0.6 * (1 +  R163/R164 )
- 主控电源部分
- 后续请勿更新库，相关管脚会修改。
